# Altium project control_block_raspberry_pi_pico.PrjPcb
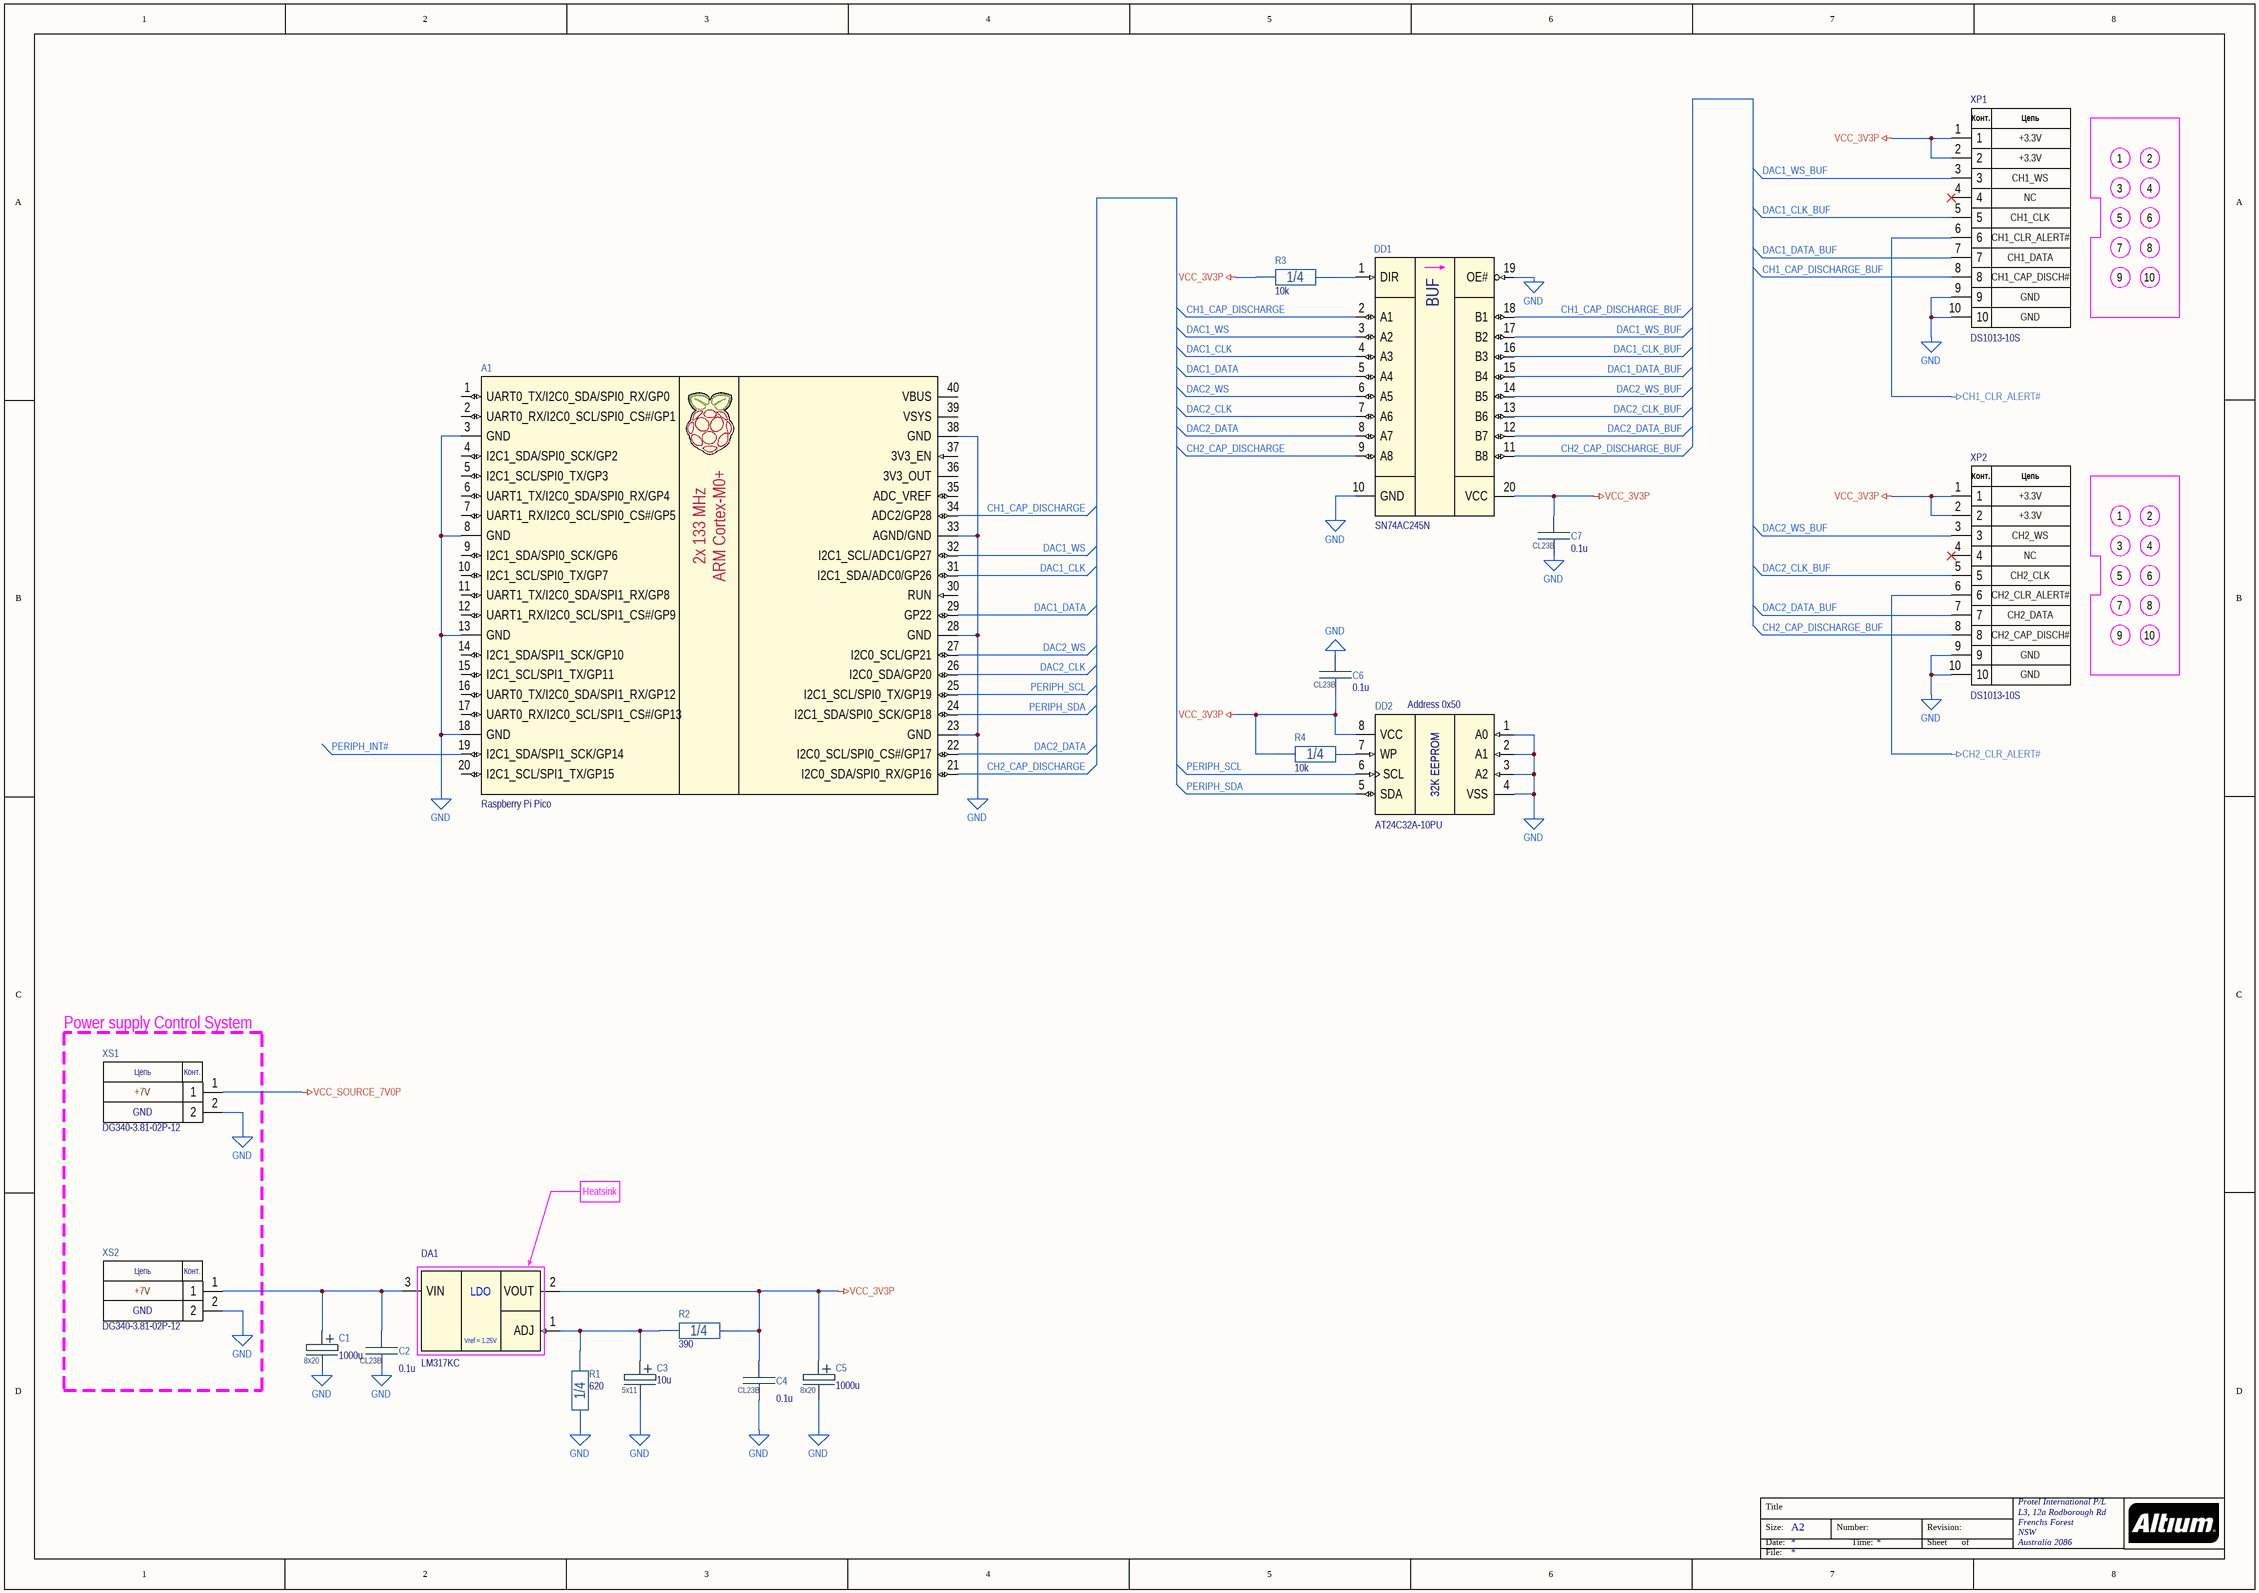
[diagram p0: p1_control_block.SchDoc]
4 sheets, 234 parts. Net scope: global (net labels, ports and power ports of the same name join across sheets).
Sheets:
  p1_control_block.SchDoc
  p2_eth_rs232.SchDoc
  p3_keypad_encoder_led.SchDoc
  p4_power_measure_ch1.SchDoc

## Sheet p1_control_block.SchDoc
size A2; Organization: Protel International P/L; Address1: L3, 12a Rodborough Rd; Address2: Frenchs Forest; Address3: NSW; Address4: Australia 2086

### Parts
A1  Raspberry Pi Pico  [Raspberry_Pi_Pico]
C1  1000u  Package: 8x20  [ECAP8X20X3.5_BRW]
C2  0.1u  [CL23B_7.2x2.5]
C3  10u  Package: 5x11  [ECAP5X11X2.0_BRW]
C4  0.1u  [CL23B_7.2x2.5]
C5  1000u  Package: 8x20  [ECAP8X20X3.5_BRW]
C6  0.1u  [CL23B_7.2x2.5]
C7  0.1u  [CL23B_7.2x2.5]
DA1  LM317KC  [TO-220A-3]
DD1  SN74AC245N  [DIP-20P-M01]
DD2  AT24C32A-10PU  [DIP-8P-M01_with_SO8]
R1  620  Package: 1/4  [CFR-25]
R2  390  Package: 1/4  [CFR-25]
R3  10k  Package: 1/4  [CFR-25]
R4  10k  Package: 1/4  [CFR-25]
XP1  DS1013-10S  [BH-10]
XP2  DS1013-10S  [BH-10]
XS1  DG340-3.81-02P-12  [DG340-3.81-02P]
XS2  DG340-3.81-02P-12  [DG340-3.81-02P]

### Blocks framed on the sheet
Power supply Control System: XS1 XS2

### Nets
CH1_CLR_ALERT#: XP1.6
CH2_CLR_ALERT#: XP2.6
GND: A1.3(GND) A1.8(GND) A1.13(GND) A1.18(GND) A1.23(GND) A1.28(GND) A1.33(AGND/GND) A1.38(GND) C1.2 C2.2 C3.2 C4.2 C5.2 C6.1 C7.2 DD1.10(GND) DD1.19(OE#) DD2.1(A0) DD2.2(A1) DD2.3(A2) DD2.4(VSS) R1.1 XP1.9 XP1.10 XP2.9 XP2.10 XS1.2 XS2.2
PERIPH_INT#: A1.19(I2C1_SDA/SPI1_SCK/GP14)
PERIPH_SCL: A1.25(I2C1_SCL/SPI0_TX/GP19) DD2.6(SCL)
PERIPH_SDA: A1.24(I2C1_SDA/SPI0_SCK/GP18) DD2.5(SDA)
VCC_3V3P: C4.1 C5.1 C6.2 C7.1 DA1.2(VOUT) DD1.20(VCC) DD2.8(VCC) R2.1 R3.1 R4.1 XP1.1 XP1.2 XP2.1 XP2.2
VCC_SOURCE_7V0P: XS1.1
CH1_CAP_DISCHARGE: A1.34(ADC2/GP28) DD1.2(A1)
CH1_CAP_DISCHARGE_BUF: DD1.18(B1) XP1.8
CH2_CAP_DISCHARGE: A1.21(I2C0_SDA/SPI0_RX/GP16) DD1.9(A8)
CH2_CAP_DISCHARGE_BUF: DD1.11(B8) XP2.8
DAC1_CLK: A1.31(I2C1_SDA/ADC0/GP26) DD1.4(A3)
DAC1_CLK_BUF: DD1.16(B3) XP1.5
DAC1_DATA: A1.29(GP22) DD1.5(A4)
DAC1_DATA_BUF: DD1.15(B4) XP1.7
DAC1_WS: A1.32(I2C1_SCL/ADC1/GP27) DD1.3(A2)
DAC1_WS_BUF: DD1.17(B2) XP1.3
DAC2_CLK: A1.26(I2C0_SDA/GP20) DD1.7(A6)
DAC2_CLK_BUF: DD1.13(B6) XP2.5
DAC2_DATA: A1.22(I2C0_SCL/SPI0_CS#/GP17) DD1.8(A7)
DAC2_DATA_BUF: DD1.12(B7) XP2.7
DAC2_WS: A1.27(I2C0_SCL/GP21) DD1.6(A5)
DAC2_WS_BUF: DD1.14(B5) XP2.3
NetC1_1: C1.1 C2.1 DA1.3(VIN) XS2.1
NetC3_1: C3.1 DA1.1(ADJ) R1.2 R2.2
NetDD1_1: DD1.1(DIR) R3.2
NetDD2_7: DD2.7(WP) R4.2

Not connected (* = marked no-connect by the designer): A1 1(UART0_TX/I2C0_SDA/SPI0_RX/GP0) 2(UART0_RX/I2C0_SCL/SPI0_CS#/GP1) 4(I2C1_SDA/SPI0_SCK/GP2) 5(I2C1_SCL/SPI0_TX/GP3) 6(UART1_TX/I2C0_SDA/SPI0_RX/GP4) 7(UART1_RX/I2C0_SCL/SPI0_CS#/GP5) 9(I2C1_SDA/SPI0_SCK/GP6) 10(I2C1_SCL/SPI0_TX/GP7) 11(UART1_TX/I2C0_SDA/SPI1_RX/GP8) 12(UART1_RX/I2C0_SCL/SPI1_CS#/GP9) 14(I2C1_SDA/SPI1_SCK/GP10) 15(I2C1_SCL/SPI1_TX/GP11) 16(UART0_TX/I2C0_SDA/SPI1_RX/GP12) 17(UART0_RX/I2C0_SCL/SPI1_CS#/GP13) 20(I2C1_SCL/SPI1_TX/GP15) 30(RUN) 35(ADC_VREF) 36(3V3_OUT) 37(3V3_EN) 39(VSYS) 40(VBUS); XP1 4*; XP2 4*

### Notes on the sheet
- +3.3V
- CH1_WS
- NC
- 1
- 3
- 2
- 4
- CH1_CLK
- (near XP1) CH1_CLR_ALERT#
- 5
- 7
- 6
- 8
- GND
- (near XP1) CH1_DATA
- (near XP1) CH1_CAP_DISCH#
- 9
- 10
- CH2_WS
- CH2_CLK
- (near XP2) CH2_CLR_ALERT#
- (near XP2) CH2_DATA
- (near XP2) CH2_CAP_DISCH#
- (near DD2) Address 0x50
- +7V
- Heatsink
- Title
- Size:
- Date:
- File:
- A2
- Number:
- Time:
- Revision:
- Sheet
- of
- (in symbol AT24C32A-10PU) 32K EEPROM
- (in symbol BH-10) Конт.; Цепь
- (in symbol DG340-3.81-02P-12) Цепь; Конт.
- (in symbol LM317KC) LDO; Vref = 1.25V
- (in symbol Raspberry Pi Pico) 2x 133 MHz; ARM Cortex-M0+
- (in symbol SN74AC245N) BUF

### Library data of the parts
A1 = Raspberry Pi Pico: Board Raspberry Pi Pico; Part Number: Raspberry Pi Pico; Manufacturer: Raspberry Pi
C1 C5 = C_ECAP: Aluminium capacitor; Part Number: UHV1C102MPD6; Manufacturer: Nichicon; Tolerance: ± 20 %; Voltage: 16V; Value: 1000u; Value on schem: 1000u
C2 C4 C6 C7 = CL23B: Box-type metallized polyester film capacitor; Tolerance: ± * %; Voltage: 63V; Value: 0.1u; Dielectric: Polyester; Value on schem: 0.1u; Part Number: *; Manufacturer: *; Package: CL23B
C3 = C_ECAP: Aluminium capacitor; Part Number: UVR1J100MDD1TA; Manufacturer: Nichicon; Tolerance: ± 20 %; Voltage: 63V; Value: 10u; Value on schem: 10u
DA1 = LM317KC: 1.5 A 3-Terminal Adjustable Regulator; Manufacturer: Texas Instruments; Package: TO-220; Part Number: LM317KC
DD1 = SN74AC245N: 8-bit Bus Transceiver with 3-state outputs; Manufacturer: Texas Instruments; Part Number: SN74AC245N; Package: DIP-20
DD2 = AT24C32A-10PU: 32K I2C Serial EEPROM; Manufacturer: Microchip Technology; Package: DIP-8; Part Number: AT24C32A-10PU
R1 = CF25: Resistor 1/4W; Part Number: MFR-25FTF52-620R; Manufacturer: Yageo; Tolerance: ± 1 %; Voltage: 250V; Temperature Coefficient: ±100 ppm/°C; Value: 620; Value on schem: 620
R2 = CF25: Resistor 1/4W; Part Number: MFR-25FTF52-390R; Manufacturer: Yageo; Tolerance: ± 1 %; Voltage: 250V; Temperature Coefficient: ±100 ppm/°C; Value: 390; Value on schem: 390
R3 R4 = CF25: Resistor 1/4W; Part Number: MFR-25FTF52-10K; Manufacturer: Yageo; Tolerance: ± 1 %; Voltage: 250V; Temperature Coefficient: ±100 ppm/°C; Value: 10k; Value on schem: 10k
XP1 XP2 = BH-10: 10-pin 2.54 mm Box header elevator type; Manufacturer: Connfly; Part Number: DS1013-10S
XS1 XS2 = DG340-3.81-02P-12: 2-way screw terminal, pitch 150mils (3.81mm); Manufacturer: DEGSON; Part Number: DG340-3.81-02P-12

## Sheet p2_eth_rs232.SchDoc
size A1; Organization: Protel International P/L; Address1: L3, 12a Rodborough Rd; Address2: Frenchs Forest; Address3: NSW; Address4: Australia 2086
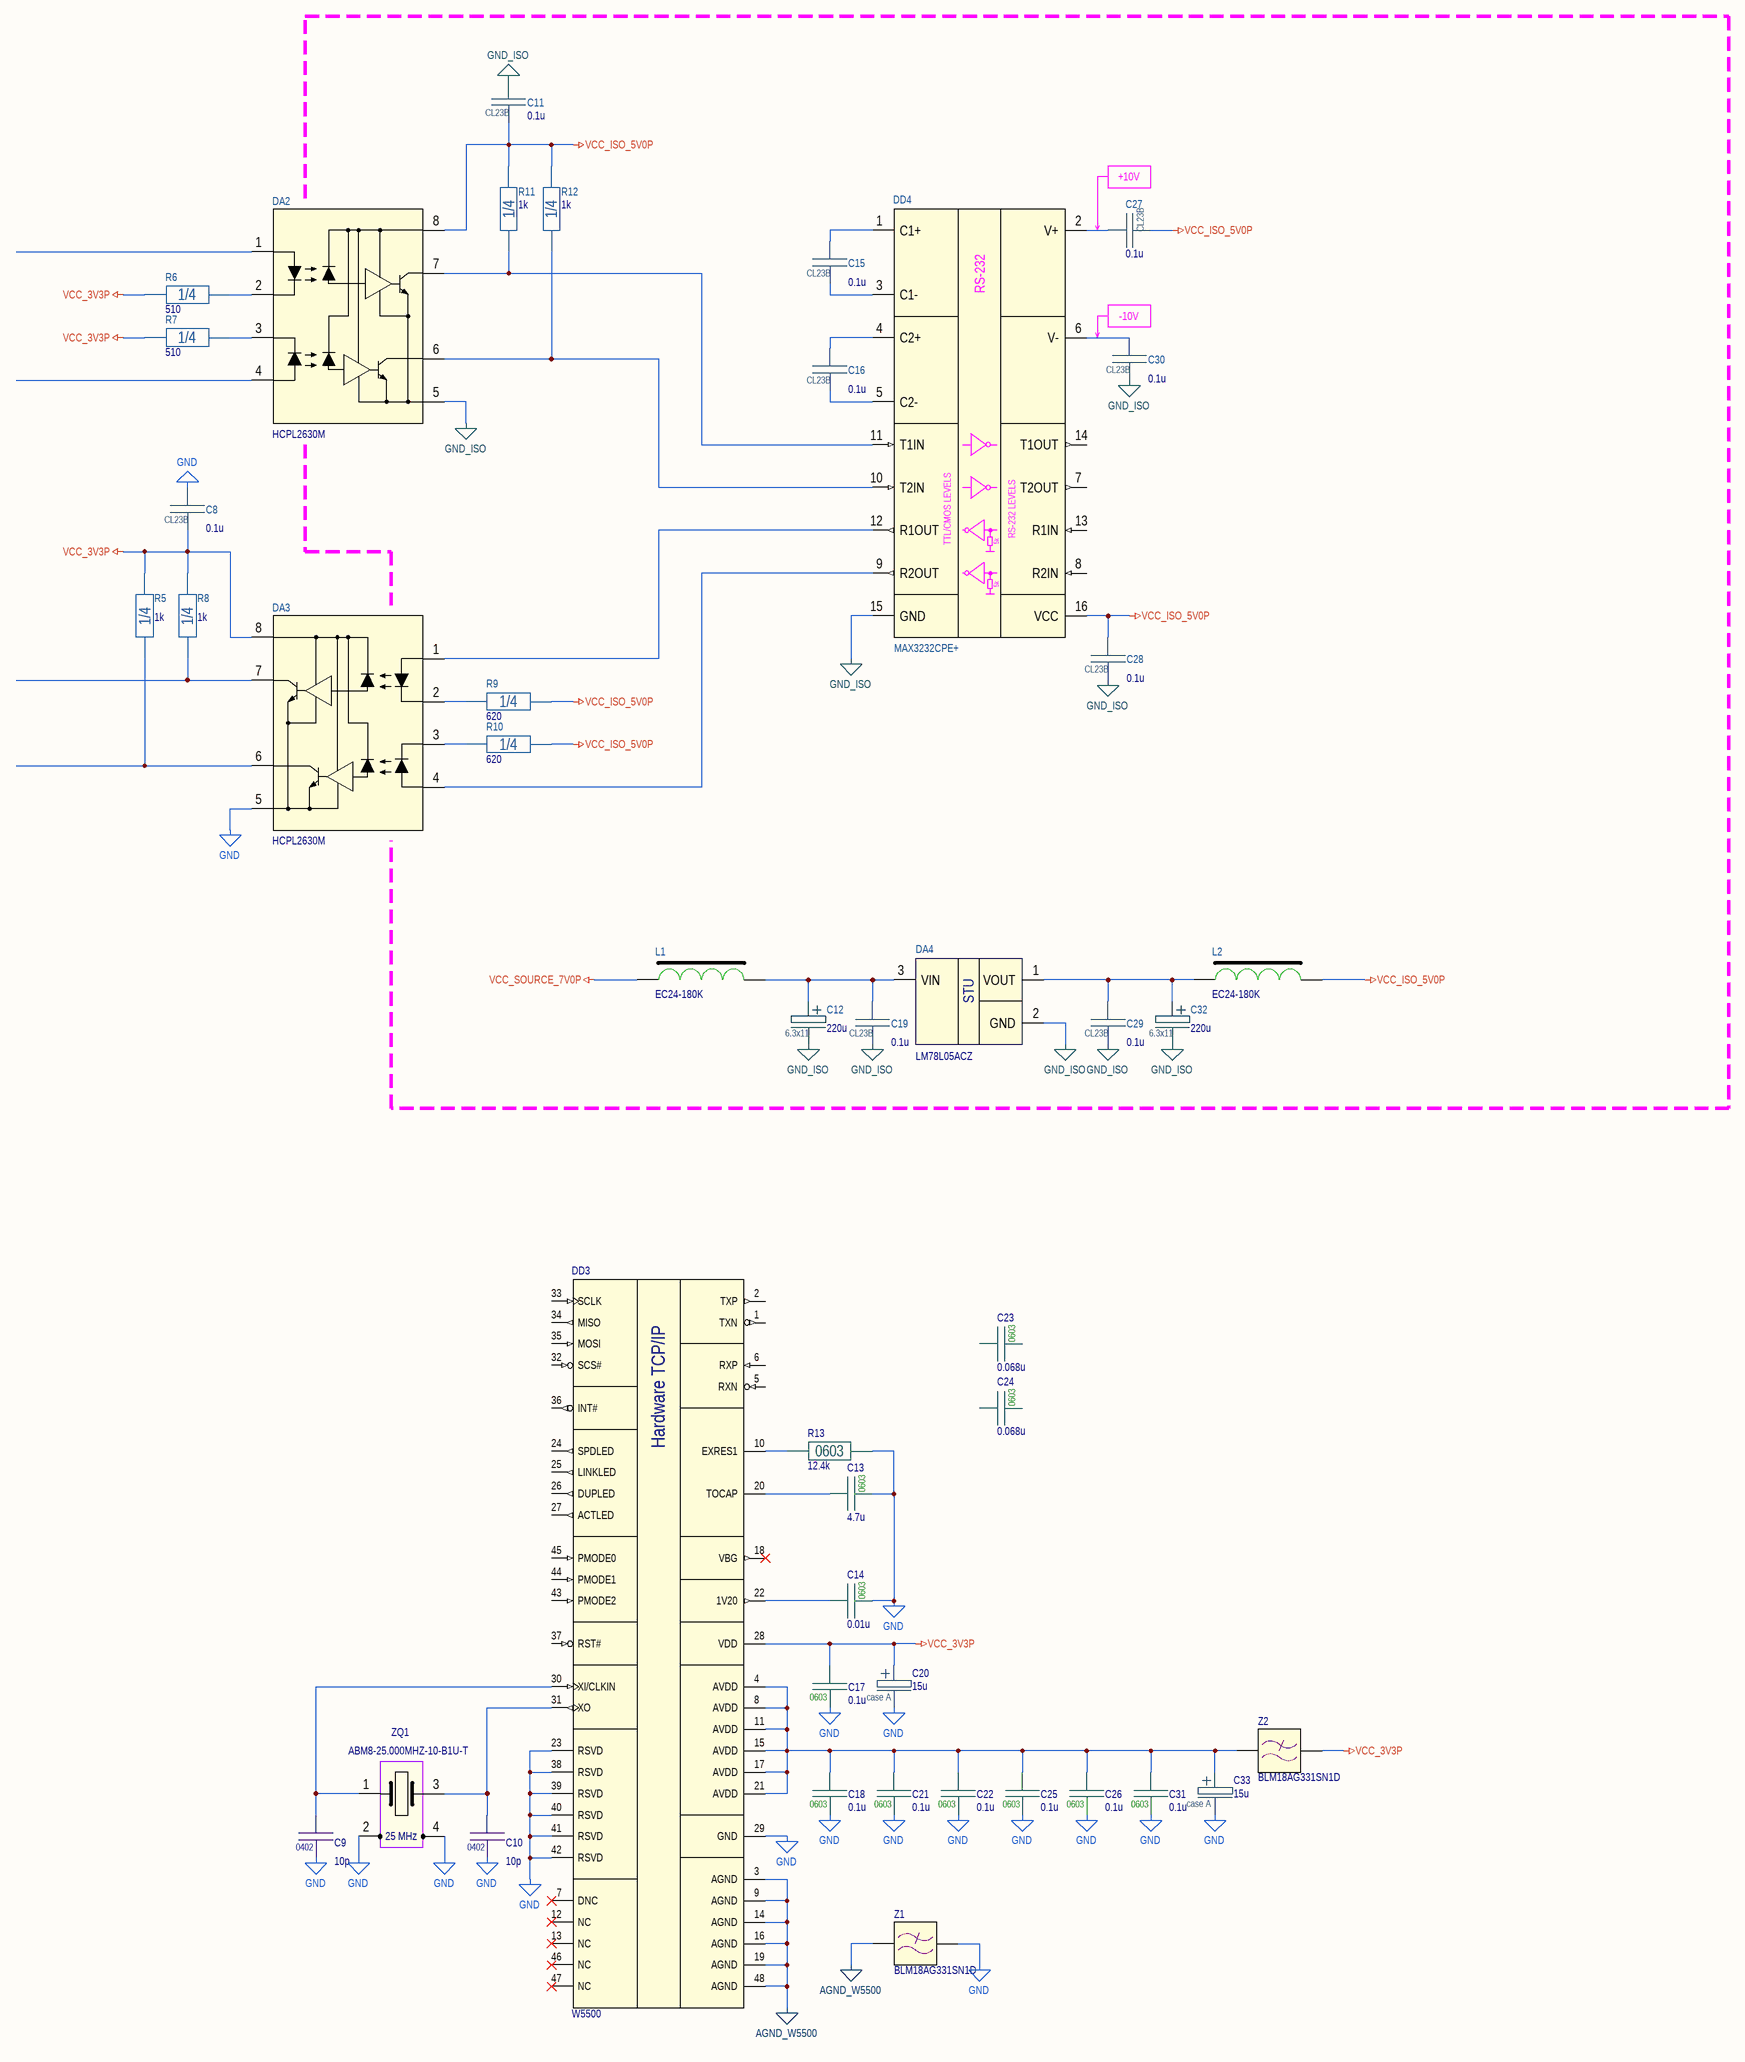
[diagram p1: p2_eth_rs232.SchDoc]

### Parts
C8  0.1u  [CL23B_7.2x2.5]
C9  10p  Package: 0402  [CAP0402]
C10  10p  Package: 0402  [CAP0402]
C11  0.1u  [CL23B_7.2x2.5]
C12  220u  Package: 6.3x11  [ECAP6.3X11X2.5_BRW]
C13  4.7u  Package: 0603  [CAP0603]
C14  0.01u  Package: 0603  [CAP0603]
C15  0.1u  [CL23B_7.2x2.5]
C16  0.1u  [CL23B_7.2x2.5]
C17  0.1u  Package: 0603  [CAP0603]
C18  0.1u  Package: 0603  [CAP0603]
C19  0.1u  [CL23B_7.2x2.5]
C20  15u  Package: case A  [CAP_CASE_A]
C21  0.1u  Package: 0603  [CAP0603]
C22  0.1u  Package: 0603  [CAP0603]
C23  0.068u  Package: 0603  [CAP0603]
C24  0.068u  Package: 0603  [CAP0603]
C25  0.1u  Package: 0603  [CAP0603]
C26  0.1u  Package: 0603  [CAP0603]
C27  0.1u  [CL23B_7.2x2.5]
C28  0.1u  [CL23B_7.2x2.5]
C29  0.1u  [CL23B_7.2x2.5]
C30  0.1u  [CL23B_7.2x2.5]
C31  0.1u  Package: 0603  [CAP0603]
C32  220u  Package: 6.3x11  [ECAP6.3X11X2.5_BRW]
C33  15u  Package: case A  [CAP_CASE_A]
DA2  HCPL2630M  [DIP-8P-M01]
DA3  HCPL2630M  [DIP-8P-M01]
DA4  LM78L05ACZ  [TO-92 (VERTICAL,LINE)]
DD3  W5500  [LQFP-48]
DD4  MAX3232CPE+  [DIP-16P-M03]
L1  EC24-180K  [EC24_GREEN]
L2  EC24-180K  [EC24_GREEN]
R5  1k  Package: 1/4  [CFR-25]
R6  510  Package: 1/4  [CFR-25]
R7  510  Package: 1/4  [CFR-25]
R8  1k  Package: 1/4  [CFR-25]
R9  620  Package: 1/4  [CFR-25]
R10  620  Package: 1/4  [CFR-25]
R11  1k  Package: 1/4  [CFR-25]
R12  1k  Package: 1/4  [CFR-25]
R13  12.4k  Package: 0603  [RES0603B]
Z1  BLM18AG331SN1D  [BLM0603P]
Z2  BLM18AG331SN1D  [BLM0603P]
ZQ1  ABM8-25.000MHZ-10-B1U-T  [SMD3225]

### Nets
AGND_W5500: DD3.3(AGND) DD3.9(AGND) DD3.14(AGND) DD3.16(AGND) DD3.19(AGND) DD3.48(AGND) Z1.2
GND: C8.1 C9.1 C10.1 C13.2 C14.2 C17.1 C18.1 C20.2 C21.1 C22.1 C25.1 C26.1 C31.1 C33.2 DA3.5(GND) DD3.23(RSVD) DD3.29(GND) DD3.38(RSVD) DD3.39(RSVD) DD3.40(RSVD) DD3.41(RSVD) DD3.42(RSVD) R13.2 Z1.1 ZQ1.2(GND) ZQ1.4(GND)
GND_ISO: C11.1 C12.2 C19.2 C28.2 C29.2 C30.2 C32.2 DA2.5(GND) DA4.2(GND) DD4.15(GND)
VCC_3V3P: C8.2 C17.2 C20.1 DA3.8(VCC) DD3.28(VDD) R5.1 R6.1 R7.1 R8.1 Z2.1
VCC_ISO_5V0P: C11.2 C27.2 C28.1 DA2.8(VCC) DD4.16(VCC) L2.2 R9.1 R10.1 R11.1 R12.1
VCC_SOURCE_7V0P: L1.1
NetC9_2: C9.2 DD3.30(XI/CLKIN) ZQ1.1(XTAL0)
NetC10_2: C10.2 DD3.31(XO) ZQ1.3(XTAL1)
NetC12_1: C12.1 C19.1 DA4.3(VIN) L1.2
NetC13_1: C13.1 DD3.20(TOCAP)
NetC14_1: C14.1 DD3.22(1V20)
NetC15_1: C15.1 DD4.1(C1+)
NetC15_2: C15.2 DD4.3(C1-)
NetC16_1: C16.1 DD4.4(C2+)
NetC16_2: C16.2 DD4.5(C2-)
NetC18_2: C18.2 C21.2 C22.2 C25.2 C26.2 C31.2 C33.1 DD3.4(AVDD) DD3.8(AVDD) DD3.11(AVDD) DD3.15(AVDD) DD3.17(AVDD) DD3.21(AVDD) Z2.2
NetC27_1: C27.1 DD4.2(V+)
NetC29_1: C29.1 C32.1 DA4.1(VOUT) L2.1
NetC30_1: C30.1 DD4.6(V-)
NetDA2_2: DA2.2(CATHODE1) R6.2
NetDA2_3: DA2.3(CATHODE2) R7.2
NetDA2_6: DA2.6(V02) DD4.10(T2IN) R12.2
NetDA2_7: DA2.7(V01) DD4.11(T1IN) R11.2
NetDA3_1: DA3.1(ANODE1) DD4.12(R1OUT)
NetDA3_2: DA3.2(CATHODE1) R9.2
NetDA3_3: DA3.3(CATHODE2) R10.2
NetDA3_4: DA3.4(ANODE2) DD4.9(R2OUT)
NetDA3_6: DA3.6(V02) R5.2
NetDA3_7: DA3.7(V01) R8.2
NetDD3_10: DD3.10(EXRES1) R13.1

Not connected (* = marked no-connect by the designer): C23 1 2; C24 1 2; DA2 1(ANODE1) 4(ANODE2); DD3 1(TXN) 2(TXP) 5(RXN) 6(RXP) 7(DNC)* 12(NC)* 13(NC)* 18(VBG)* 24(SPDLED) 25(LINKLED) 26(DUPLED) 27(ACTLED) 32(SCS#) 33(SCLK) 34(MISO) 35(MOSI) 36(INT#) 37(RST#) 43(PMODE2) 44(PMODE1) 45(PMODE0) 46(NC)* 47(NC)*; DD4 7(T2OUT) 8(R2IN) 13(R1IN) 14(T1OUT)

### Notes on the sheet
- +10V
- -10V
- Title
- Size:
- Date:
- File:
- A1
- Number:
- Time:
- Revision:
- Sheet
- of
- (in symbol ABM8-25.000MHZ-10-B1U-T) 25 MHz
- (in symbol LM78L05ACZ) STU
- (in symbol MAX3232CPE+) RS-232; TTL/CMOS LEVELS; RS-232 LEVELS; 5k
- (in symbol W5500) Hardware TCP/IP

### Library data of the parts
C8 C11 C15 C16 C19 C27-C30 = CL23B: as C2 on sheet p1_control_block; Value: 0.1u; Dielectric: Polyester; Value on schem: 0.1u; Part Number: *; Manufacturer: *; Package: CL23B
C9 C10 = C0402: Capacitors 0402 package case; Part Number: CL05C100JB5NNNC; Manufacturer: Samsung Sdi Co.ltd(SAMSUNG); Tolerance: ± 10 %; Dielectric: NP0; Voltage: 50 V; Value: 10p; Value on schem: 10p
C12 C32 = C_ECAP: Aluminium capacitor; Part Number: EKZH160ELL221MF11D; Manufacturer: Nichicon; Tolerance: ± 20 %; Voltage: 16V; Value: 220u; Value on schem: 220u
C13 = C0603: Capacitors 0603 package case; Part Number: CL10A475MO8NNNC; Manufacturer: Samsung Sdi Co. Ltd; Tolerance: ± 10 %; Dielectric: X5R; Voltage: 16 V; Value: 4.7u; Value on schem: 4.7u
C14 = C0603: Capacitors 0603 package case; Part Number: CL10B103KB8NNNL; Manufacturer: Samsung Sdi Co. Ltd; Tolerance: ± 10 %; Dielectric: X7R; Voltage: 50 V; Value: 0.01u; Value on schem: 0.01u
C17 C18 C21 C22 C25 C26 C31 = C0603: Capacitors 0603 package case; Part Number: CL10B104KB8NNNC; Manufacturer: Samsung Sdi Co. Ltd; Tolerance: ± 10 %; Dielectric: X7R; Voltage: 50V; Value: 0.1u; Value on schem: 0.1u
C20 C33 = C_CASEA: Tantalum capacitors case A; Part Number: 293D156X96R3A2TE3; Manufacturer: Vishay Intertechnology Inc.; Tolerance: ± 10 %; Voltage: 6.3V; ESR: 2.9Ohm @ 100 kHz; Value: 15u; Value on schem: 15u; Series: 293D
C23 C24 = C0603: Capacitors 0603 package case; Part Number: CL10B683KB8NNNC; Manufacturer: Samsung Sdi Co. Ltd; Tolerance: ± 10 %; Dielectric: X7R; Voltage: 50 V; Value: 0.068u; Value on schem: 0.068u
DA2 DA3 = HCPL2630M: Dual-Channel High-Speed 10 MBit/s Logic Gate Optocouplers; Manufacturer: ON Semiconductor; Package: DIP-8; Part Number: HCPL2630M
DA4 = LM78L05ACZ: 100-mA Fixed Output Linear Regulator; Manufacturer: Texas Instruments; Part Number: LM78L05ACZ; Package: TO-92
DD3 = W5500: Hardwired TCP/IP embedded Ethernet controller; Manufacturer: WIZnet; Part Number: W5500; Package: LQFP-64
DD4 = MAX3232CPE+: 3.0V to 5.5V, Low-Power, Up to 1Mbps, True RS-232 Transceivers; Manufacturer: Maxim Integrated; Part Number: MAX3232CPE+; Package: DIP-16
L1 L2 = EC24: Axial leaded coated inductors; Manufacturer: 3L Electronic; RDC: 1 Ohm; SRF Min: 15 MHz; Q: 40; Irms  Max: 315 mA; Inductance @ 100 kHz: 18 µH; Part Number: EC24-180K; Package: EC24
R5 R8 R11 R12 = CF25: Resistor 1/4W; Part Number: MFR-25FTF52-1K; Manufacturer: Yageo; Tolerance: ± 1 %; Voltage: 250V; Temperature Coefficient: ±100 ppm/°C; Value: 1k; Value on schem: 1k
R6 R7 = CF25: Resistor 1/4W; Part Number: MFR-25FTF52-510R; Manufacturer: Yageo; Tolerance: ± 1 %; Voltage: 250V; Temperature Coefficient: ±100 ppm/°C; Value: 510; Value on schem: 510
R9 R10 = CF25: as R1 on sheet p1_control_block; Value: 620; Value on schem: 620
R13 = R0603: Resistor 0603 package case; Part Number: RC0603FR-0712K4L; Manufacturer: Yageo; Tolerance: ± 1 %; Value: 12.4k; Value on schem: 12.4k
Z1 Z2 = BLM18AG331SN1D: Power line filter, imperdance 330 Ohm (current 05A); Part Number: BLM18AG331SN1D; Package: 0603
ZQ1 = ABM8-25.000MHZ-10-B1U-T: Quartz Crystal (Frequency Stability ±10ppm); Manufacturer: Abracon LLC; Load Capacitance: 10pF; PartNumber: ABM8-25.000MHZ-10-B1U-T; Package: SMD3225; Frequency Tolerance: ±10ppm; Frequency Stability: ±10ppm

## Sheet p3_keypad_encoder_led.SchDoc
size A2; Organization: Protel International P/L; Address1: L3, 12a Rodborough Rd; Address2: Frenchs Forest; Address3: NSW; Address4: Australia 2086
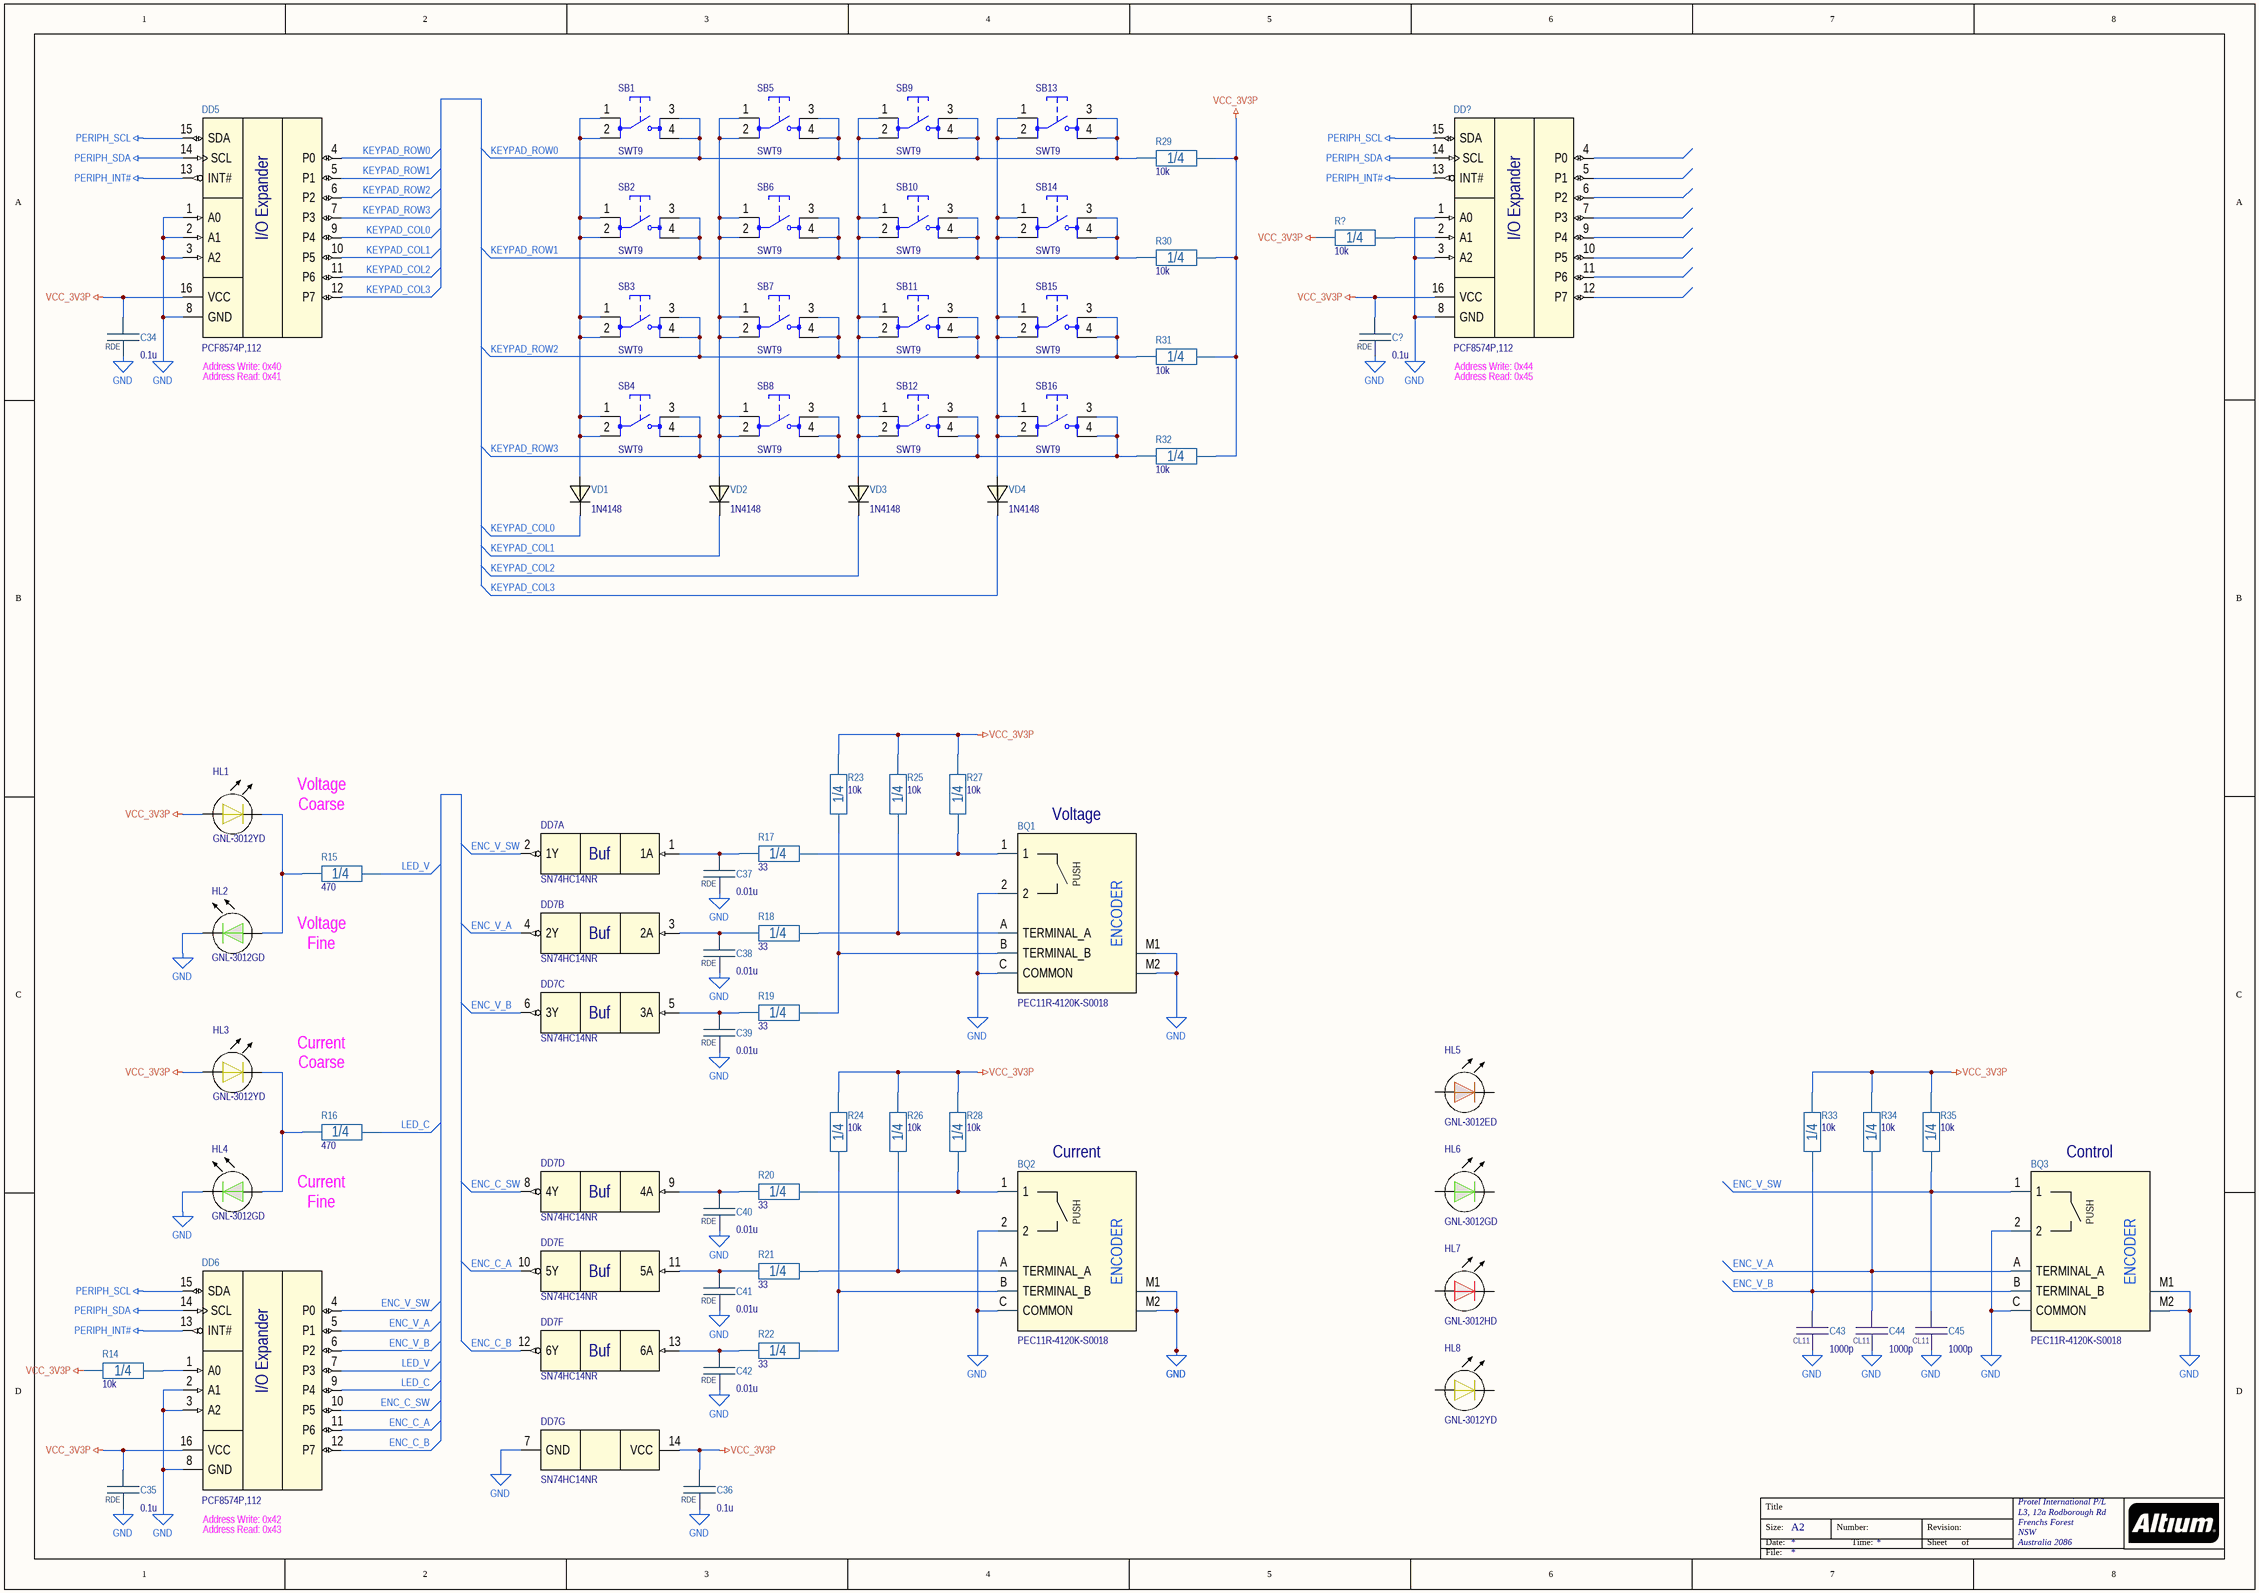
[diagram p2: p3_keypad_encoder_led.SchDoc]

### Parts
BQ1  PEC11R-4120K-S0018  [PEC11R-4120K-S0018]
BQ2  PEC11R-4120K-S0018  [PEC11R-4120K-S0018]
BQ3  PEC11R-4120K-S0018  [PEC11R-4120K-S0018]
C34  0.1u  Package: RDE  [RDE_1P1]
C35  0.1u  Package: RDE  [RDE_1P1]
C36  0.1u  Package: RDE  [RDE_1P1]
C37  0.01u  Package: RDE  [RDE_1P1]
C38  0.01u  Package: RDE  [RDE_1P1]
C39  0.01u  Package: RDE  [RDE_1P1]
C40  0.01u  Package: RDE  [RDE_1P1]
C41  0.01u  Package: RDE  [RDE_1P1]
C42  0.01u  Package: RDE  [RDE_1P1]
C43  1000p  [CL11_6x3.5_P3.5]
C44  1000p  [CL11_6x3.5_P3.5]
C45  1000p  [CL11_6x3.5_P3.5]
C?  0.1u  Package: RDE  [RDE_1P1]
DD5  PCF8574P,112  [DIP-16P-M03]
DD6  PCF8574P,112  [DIP-16P-M03]
DD7  SN74HC14NR  [DIP-14P-M02]  (parts A,B,C,D,E,F,G of 7)
DD?  PCF8574P,112  [DIP-16P-M03]
HL1  GNL-3012YD  [GNL-3012YD]
HL2  GNL-3012GD  [GNL-3012GD]
HL3  GNL-3012YD  [GNL-3012YD]
HL4  GNL-3012GD  [GNL-3012GD]
HL5  GNL-3012ED  [GNL-3012ED]
HL6  GNL-3012GD  [GNL-3012GD]
HL7  GNL-3012HD  [GNL-3012HD]
HL8  GNL-3012YD  [GNL-3012YD]
R14  10k  Package: 1/4  [CFR-25]
R15  470  Package: 1/4  [CFR-25]
R16  470  Package: 1/4  [CFR-25]
R17  33  Package: 1/4  [CFR-25]
R18  33  Package: 1/4  [CFR-25]
R19  33  Package: 1/4  [CFR-25]
R20  33  Package: 1/4  [CFR-25]
R21  33  Package: 1/4  [CFR-25]
R22  33  Package: 1/4  [CFR-25]
R23  10k  Package: 1/4  [CFR-25]
R24  10k  Package: 1/4  [CFR-25]
R25  10k  Package: 1/4  [CFR-25]
R26  10k  Package: 1/4  [CFR-25]
R27  10k  Package: 1/4  [CFR-25]
R28  10k  Package: 1/4  [CFR-25]
R29  10k  Package: 1/4  [CFR-25]
R30  10k  Package: 1/4  [CFR-25]
R31  10k  Package: 1/4  [CFR-25]
R32  10k  Package: 1/4  [CFR-25]
R33  10k  Package: 1/4  [CFR-25]
R34  10k  Package: 1/4  [CFR-25]
R35  10k  Package: 1/4  [CFR-25]
R?  10k  Package: 1/4  [CFR-25]
SB1  SWT9  [SWT9]
SB2  SWT9  [SWT9]
SB3  SWT9  [SWT9]
SB4  SWT9  [SWT9]
SB5  SWT9  [SWT9]
SB6  SWT9  [SWT9]
SB7  SWT9  [SWT9]
SB8  SWT9  [SWT9]
SB9  SWT9  [SWT9]
SB10  SWT9  [SWT9]
SB11  SWT9  [SWT9]
SB12  SWT9  [SWT9]
SB13  SWT9  [SWT9]
SB14  SWT9  [SWT9]
SB15  SWT9  [SWT9]
SB16  SWT9  [SWT9]
VD1  1N4148  [DO-35 GLASS LIGHT RED]
VD2  1N4148  [DO-35 GLASS LIGHT RED]
VD3  1N4148  [DO-35 GLASS LIGHT RED]
VD4  1N4148  [DO-35 GLASS LIGHT RED]

### Nets
GND: BQ1.2 BQ1.C(COMMON) BQ1.M1(MECHANICAL1) BQ1.M2(MECHANICAL2) BQ2.2 BQ2.C(COMMON) BQ2.M1(MECHANICAL1) BQ2.M2(MECHANICAL2) BQ3.2 BQ3.C(COMMON) BQ3.M1(MECHANICAL1) BQ3.M2(MECHANICAL2) C34.2 C35.2 C36.2 C37.2 C38.2 C39.2 C40.2 C41.2 C42.2 C43.1 C44.1 C45.1 C?.2 DD5.1(A0) DD5.2(A1) DD5.3(A2) DD5.8(GND) DD6.2(A1) DD6.3(A2) DD6.8(GND) DD7.7(GND) DD?.1(A0) DD?.3(A2) DD?.8(GND) HL2.1 HL4.1
PERIPH_INT#: DD5.13(INT#) DD6.13(INT#) DD?.13(INT#)
PERIPH_SCL: DD5.15(SDA) DD6.15(SDA) DD?.15(SDA)
PERIPH_SDA: DD5.14(SCL) DD6.14(SCL) DD?.14(SCL)
VCC_3V3P: C34.1 C35.1 C36.1 C?.1 DD5.16(VCC) DD6.16(VCC) DD7.14(VCC) DD?.16(VCC) HL1.2 HL3.2 R14.2 R23.2 R24.2 R25.2 R26.2 R27.2 R28.2 R29.1 R30.1 R31.1 R32.1 R33.2 R34.2 R35.2 R?.2
ENC_C_A: DD6.11(P6) DD7.10(5Y)
ENC_C_B: DD6.12(P7) DD7.12(6Y)
ENC_C_SW: DD6.10(P5) DD7.8(4Y)
ENC_V_A: BQ3.A(TERMINAL_A) C44.2 DD6.5(P1) DD7.4(2Y) R34.1
ENC_V_B: BQ3.B(TERMINAL_B) C43.2 DD6.6(P2) DD7.6(3Y) R33.1
ENC_V_SW: BQ3.1 C45.2 DD6.4(P0) DD7.2(1Y) R35.1
KEYPAD_COL0: DD5.9(P4) VD1.1
KEYPAD_COL1: DD5.10(P5) VD2.1
KEYPAD_COL2: DD5.11(P6) VD3.1
KEYPAD_COL3: DD5.12(P7) VD4.1
KEYPAD_ROW0: DD5.4(P0) R29.2 SB1.3 SB1.4 SB5.3 SB5.4 SB9.3 SB9.4 SB13.3 SB13.4
KEYPAD_ROW1: DD5.5(P1) R30.2 SB2.3 SB2.4 SB6.3 SB6.4 SB10.3 SB10.4 SB14.3 SB14.4
KEYPAD_ROW2: DD5.6(P2) R31.2 SB3.3 SB3.4 SB7.3 SB7.4 SB11.3 SB11.4 SB15.3 SB15.4
KEYPAD_ROW3: DD5.7(P3) R32.2 SB4.3 SB4.4 SB8.3 SB8.4 SB12.3 SB12.4 SB16.3 SB16.4
LED_C: DD6.9(P4) R16.1
LED_V: DD6.7(P3) R15.1
NetBQ1_1: BQ1.1 R17.1 R27.1
NetBQ1_A: BQ1.A(TERMINAL_A) R18.1 R25.1
NetBQ1_B: BQ1.B(TERMINAL_B) R19.1 R23.1
NetBQ2_1: BQ2.1 R20.1 R28.1
NetBQ2_A: BQ2.A(TERMINAL_A) R21.1 R26.1
NetBQ2_B: BQ2.B(TERMINAL_B) R22.1 R24.1
NetC37_1: C37.1 DD7.1(1A) R17.2
NetC38_1: C38.1 DD7.3(2A) R18.2
NetC39_1: C39.1 DD7.5(3A) R19.2
NetC40_1: C40.1 DD7.9(4A) R20.2
NetC41_1: C41.1 DD7.11(5A) R21.2
NetC42_1: C42.1 DD7.13(6A) R22.2
NetDD6_1: DD6.1(A0) R14.1
NetDD?_2: DD?.2(A1) R?.1
NetHL1_1: HL1.1 HL2.2 R15.2
NetHL3_1: HL3.1 HL4.2 R16.2
NetSB1_1: SB1.1 SB1.2 SB2.1 SB2.2 SB3.1 SB3.2 SB4.1 SB4.2 VD1.2
NetSB5_1: SB5.1 SB5.2 SB6.1 SB6.2 SB7.1 SB7.2 SB8.1 SB8.2 VD2.2
NetSB9_1: SB9.1 SB9.2 SB10.1 SB10.2 SB11.1 SB11.2 SB12.1 SB12.2 VD3.2
NetSB13_1: SB13.1 SB13.2 SB14.1 SB14.2 SB15.1 SB15.2 SB16.1 SB16.2 VD4.2

Not connected (* = marked no-connect by the designer): DD? 4(P0) 5(P1) 6(P2) 7(P3) 9(P4) 10(P5) 11(P6) 12(P7); HL5 1 2; HL6 1 2; HL7 1 2; HL8 1 2

### Notes on the sheet
- Address Write: 0x40
- Address Read: 0x41
- Address Write: 0x44
- Address Read: 0x45
- Voltage
- Coarse
- (near BQ1) Voltage
- Fine
- Current
- (near BQ2) Current
- (near BQ3) Control
- Address Write: 0x42
- Address Read: 0x43
- Title
- Size:
- Date:
- File:
- A2
- Number:
- Time:
- Revision:
- Sheet
- of
- (in symbol PCF8574P,112) I/O Expander
- (in symbol PEC11R-4120K-S0018) PUSH; ENCODER
- (in symbol SN74HC14NR, part A) Buf
- (in symbol SN74HC14NR, part B) Buf
- (in symbol SN74HC14NR, part C) Buf
- (in symbol SN74HC14NR, part D) Buf
- (in symbol SN74HC14NR, part E) Buf
- (in symbol SN74HC14NR, part F) Buf

### Library data of the parts
BQ1-BQ3 = PEC11R-4120K-S0018: 12 mm Incremental Encoder; Manufacturer: Bourns Inc.; Part Number: PEC11R-4120K-S0018
C34-C36 C? = RDE_CAP: MLCC radial lead type with epoxy coat (RDE Series); Part Number: RDER72A104K1P1H03B; Manufacturer: Murata; Tolerance: ± 10 %; Dielectric: X7R; Voltage: 100V; Value: 0.1u; Value on schem: 0.1u
C37-C42 = RDE_CAP: MLCC radial lead type with epoxy coat (RDE Series); Part Number: RDER71H103K; Manufacturer: Murata; Tolerance: ± 10 %; Dielectric: X7R; Voltage: 50V; Value: 0.01u; Value on schem: 0.01u
C43-C45 = CL11: CL11 Type Polyester Film Metal Foil Capacitor-inductive; Tolerance: ± 5 %; Voltage: 100V; Value: 1000p; Dielectric: Polyester; Value on schem: 1000p; Part Number: *; Manufacturer: *; Package: CL11
DD5 DD6 DD? = PCF8574P,112: Remote 8-bit I/O expander for I2C-bus; Manufacturer: NXP USA Inc.; Package: DIP-16; Part Number: PCF8574P,112
DD7 = SN74HC14NR: Hex Inverters with Schmitt-Trigger Inputs; Manufacturer: Texas Instruments; Part Number: SN74HC14NR; Package: DIP-14
HL1 HL3 HL8 = GNL-3012YD: Standard Brightness 3mm LED; Manufacturer: G-Nor Optoelectronics; Color: Yellow, 585 nm; Package: 3mm; Part Number: GNL-3012YD
HL2 HL4 HL6 = GNL-3012GD: Standard Brightness 3mm LED; Manufacturer: G-Nor Optoelectronics; Color: Green, 565 nm; Package: 3mm; Part Number: GNL-3012GD
HL5 = GNL-3012ED: Standard Brightness 3mm LED; Manufacturer: G-Nor Optoelectronics; Color: Orange, 635 nm; Package: 3mm; Part Number: GNL-3012ED
HL7 = GNL-3012HD: Standard Brightness 3mm LED; Manufacturer: G-Nor Optoelectronics; Color: Red, 700 nm; Package: 3mm; Part Number: GNL-3012HD
R14 R23-R35 R? = CF25: as R3 on sheet p1_control_block; Value: 10k; Value on schem: 10k
R15 R16 = CF25: Resistor 1/4W; Part Number: MFR-25FTF52-470R; Manufacturer: Yageo; Tolerance: ± 1 %; Voltage: 250V; Temperature Coefficient: ±100 ppm/°C; Value: 470; Value on schem: 470
R17-R22 = CF25: Resistor 1/4W; Part Number: MFR-25FTF52-33R; Manufacturer: Yageo; Tolerance: ± 1 %; Voltage: 250V; Temperature Coefficient: ±100 ppm/°C; Value: 33; Value on schem: 33
SB1-SB16 = SWT9: Tact Button (with tact cap SWT9S); Part Number: SWT9
VD1-VD4 = 1N4148: High-speed diode; Package: DO-35; Part Number: 1N4148

## Sheet p4_power_measure_ch1.SchDoc
size A1; Organization: Protel International P/L; Address1: L3, 12a Rodborough Rd; Address2: Frenchs Forest; Address3: NSW; Address4: Australia 2086
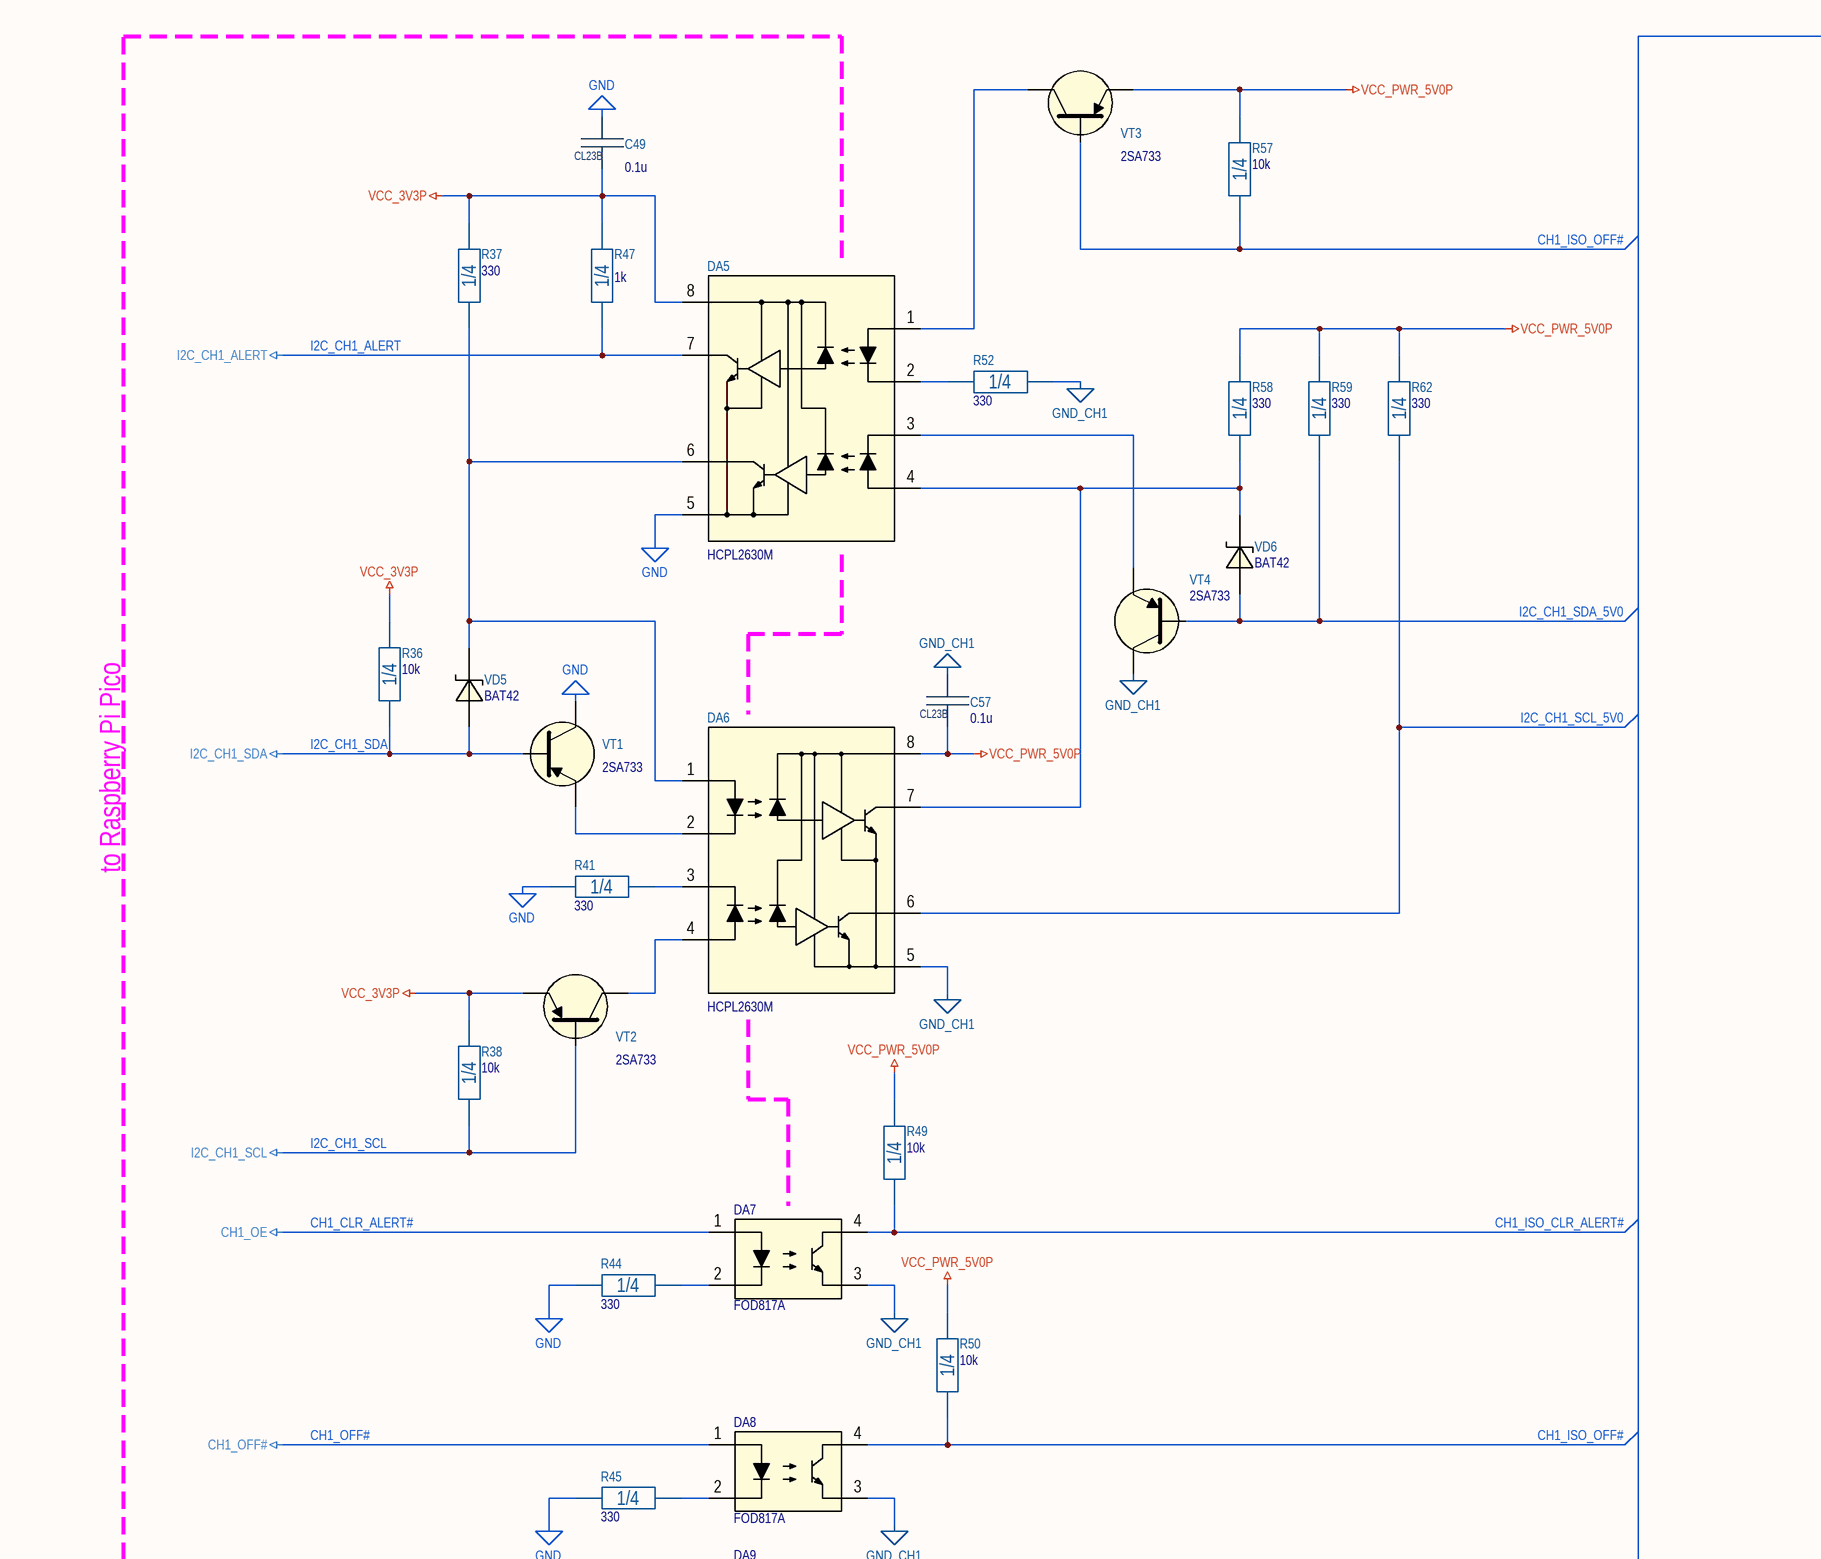
[diagram p3: p4_power_measure_ch1.SchDoc, top left]
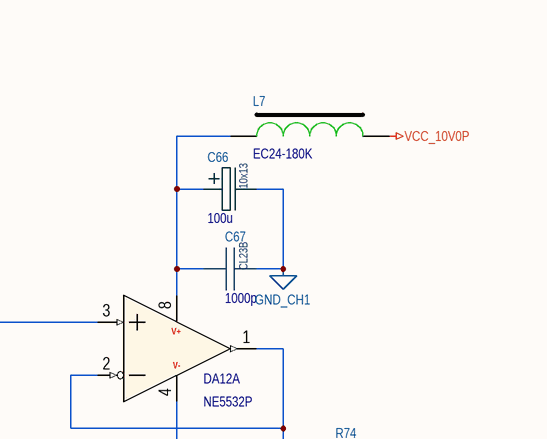
[diagram p4: p4_power_measure_ch1.SchDoc, top right]
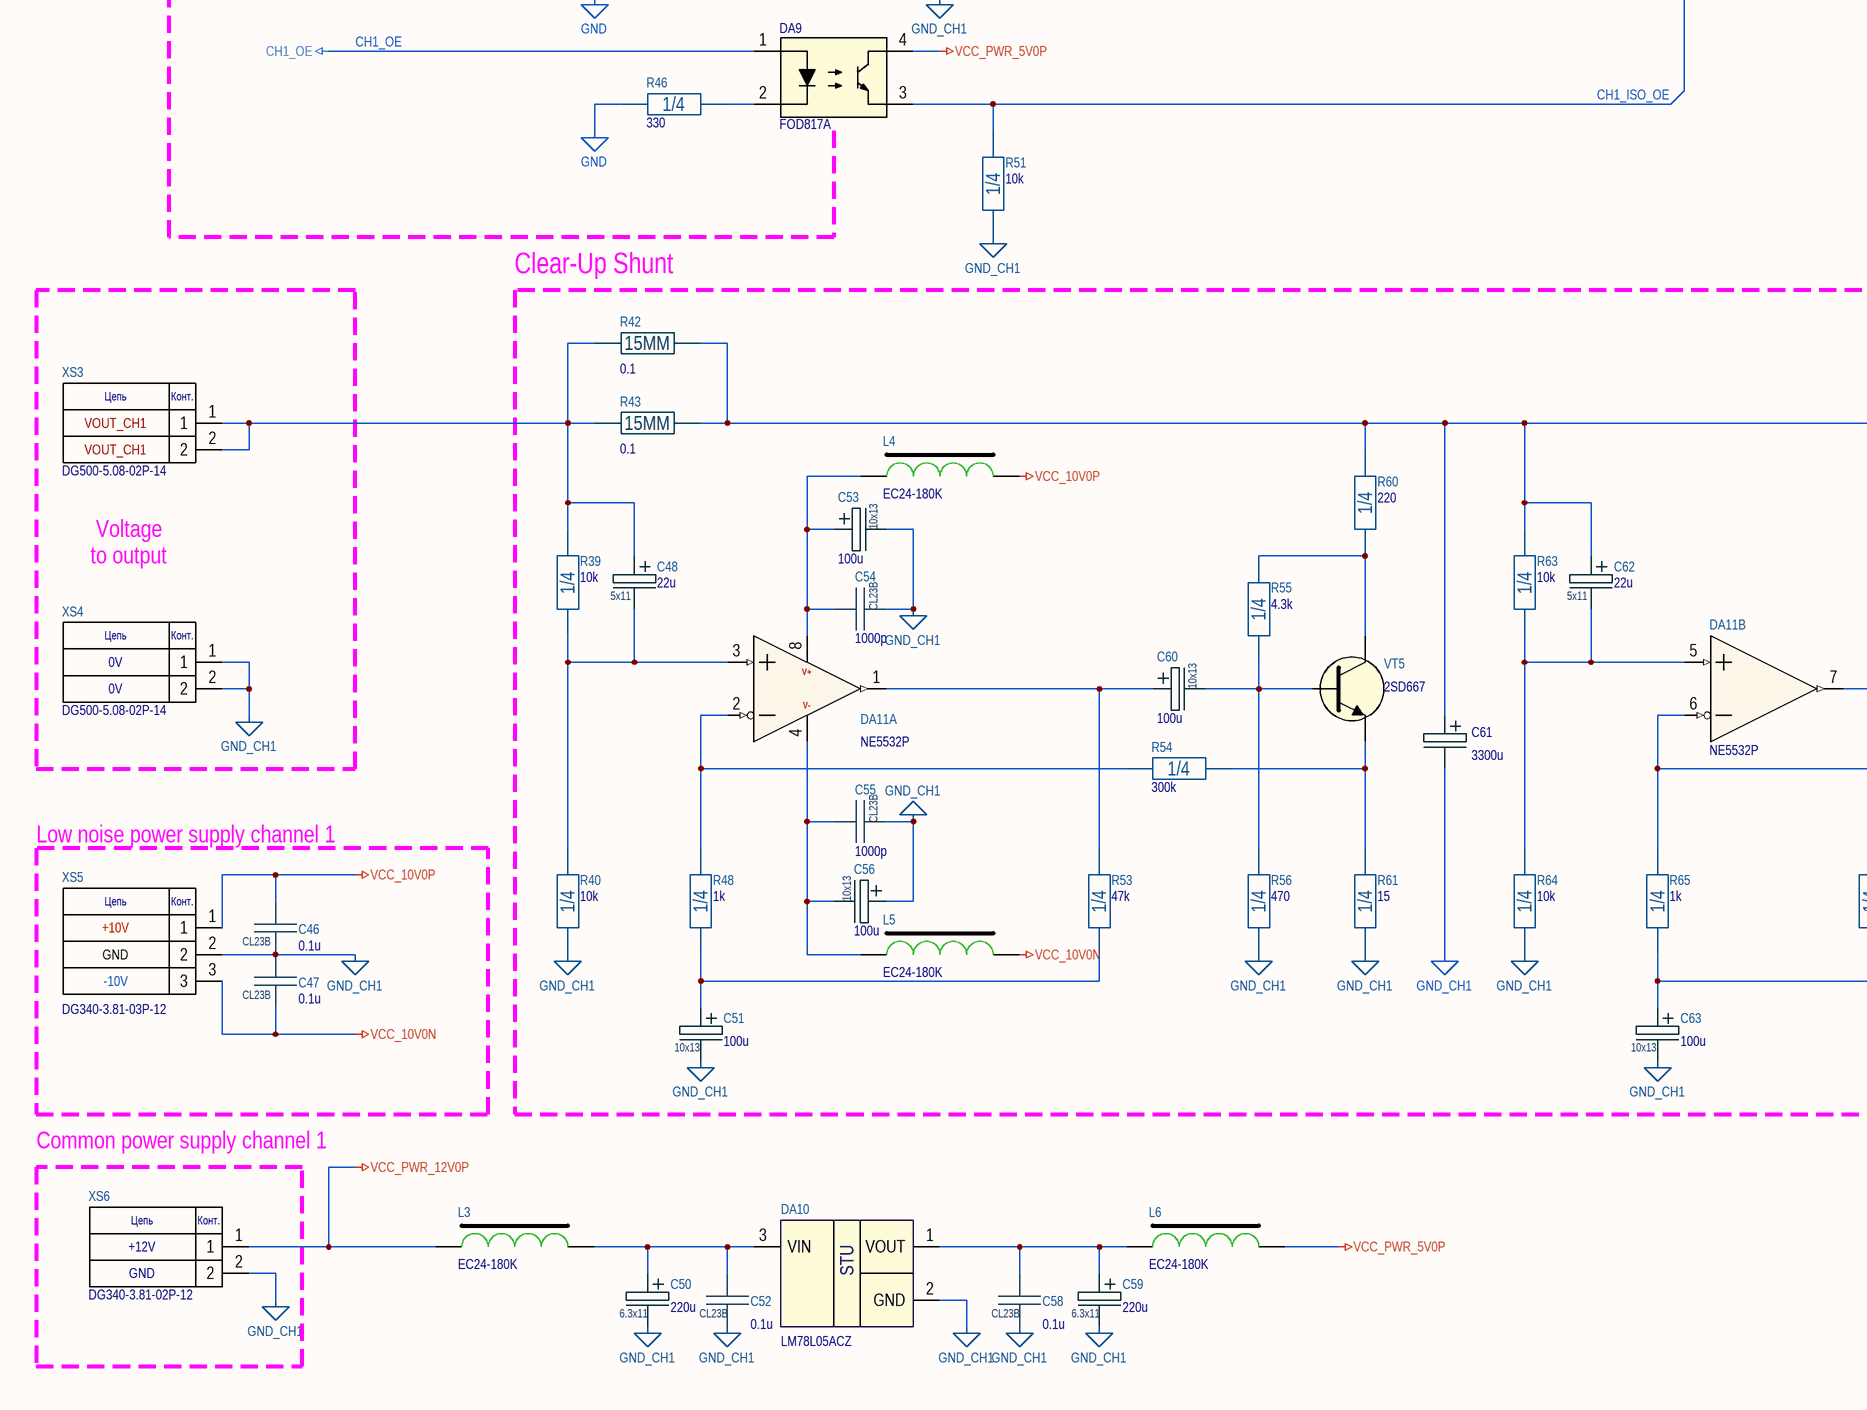
[diagram p5: p4_power_measure_ch1.SchDoc, bottom left]
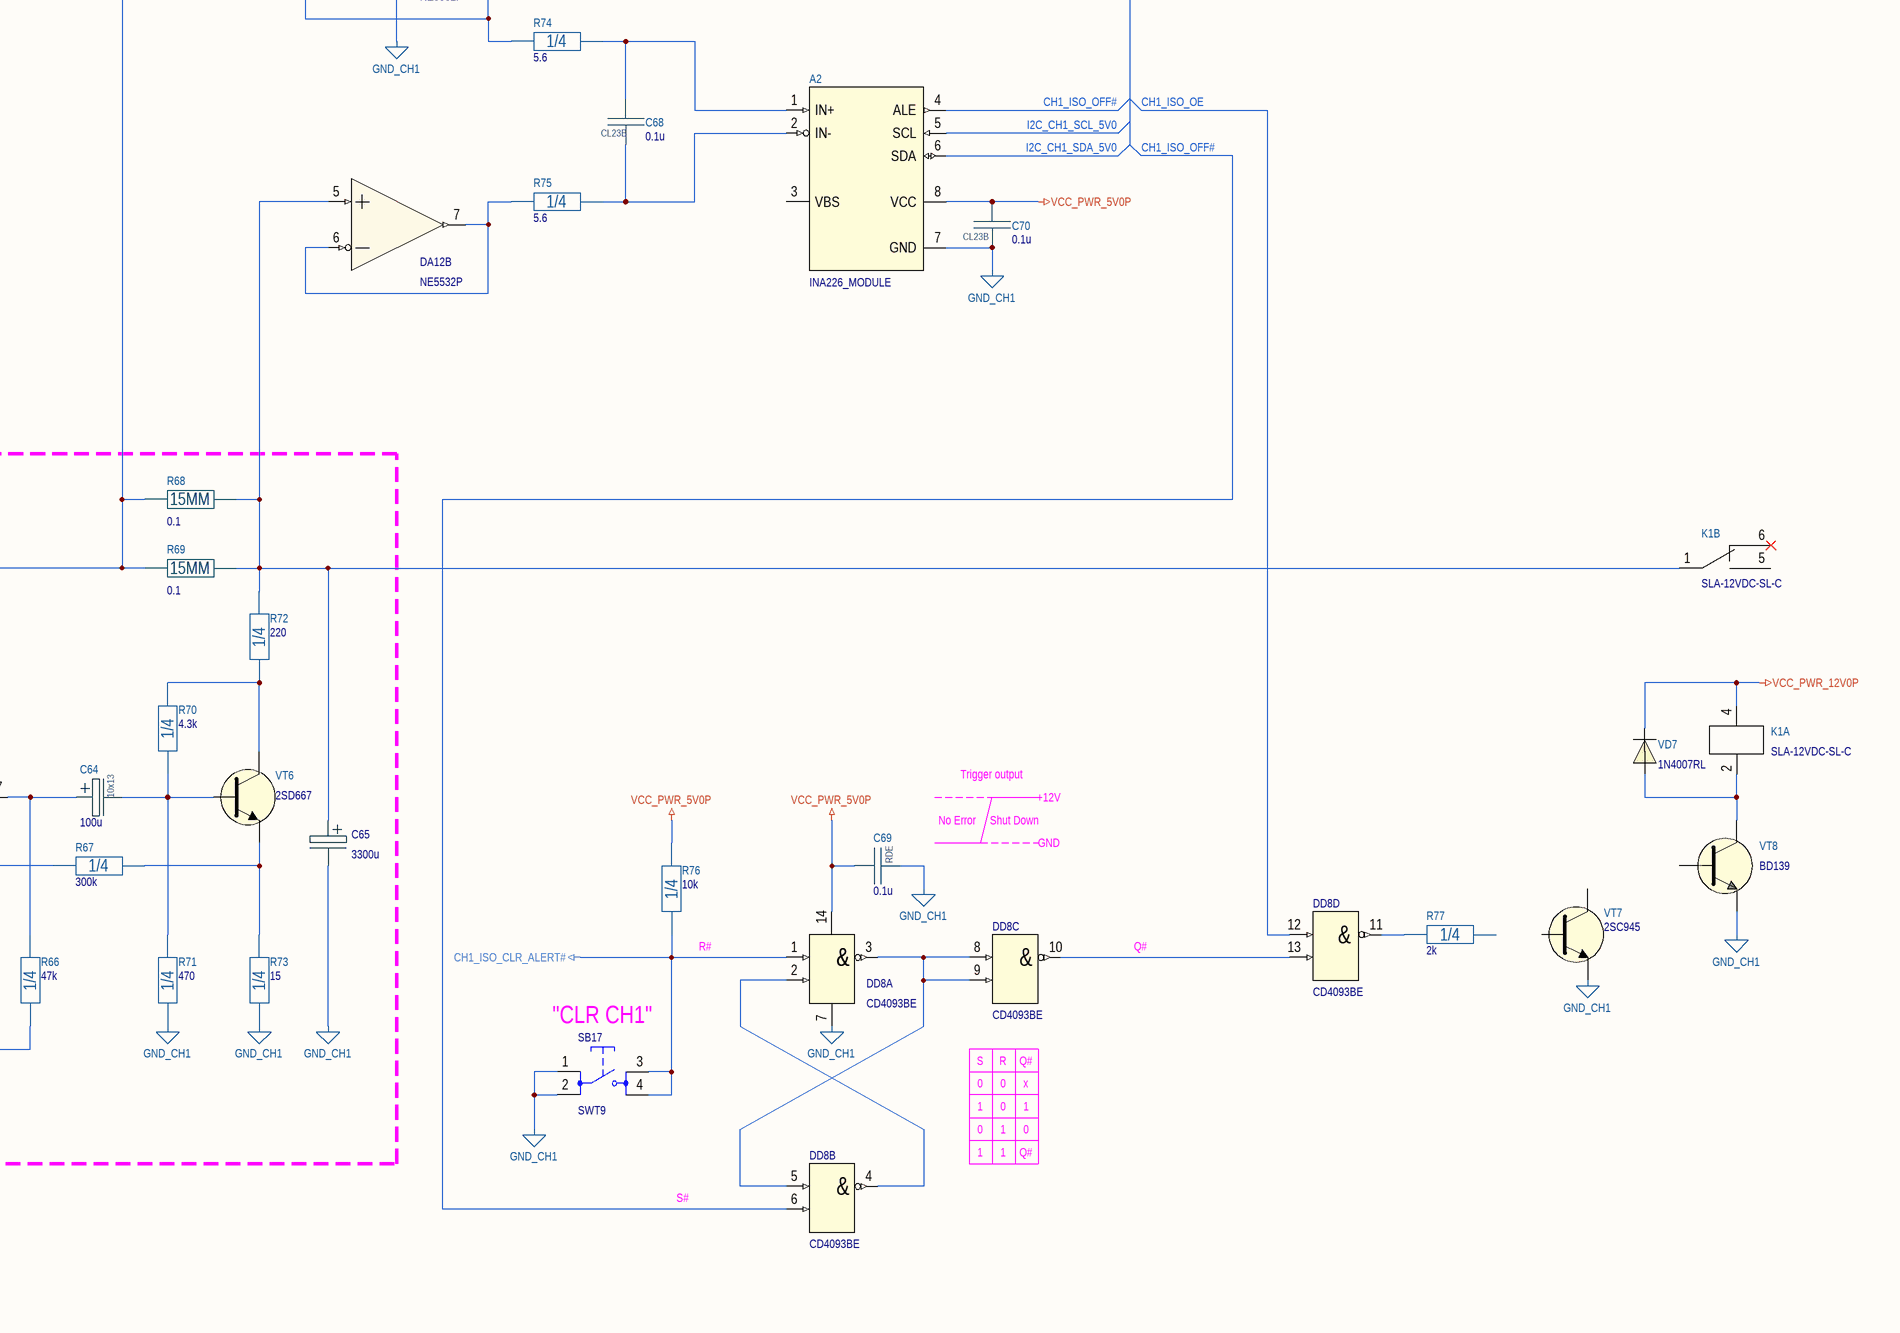
[diagram p6: p4_power_measure_ch1.SchDoc, bottom right]

### Parts
A2  INA226_MODULE  [INA226_MODULE_VERT]
C46  0.1u  [CL23B_7.2x2.5]
C47  0.1u  [CL23B_7.2x2.5]
C48  22u  Package: 5x11  [ECAP5X11X2.0_BRW]
C49  0.1u  [CL23B_7.2x2.5]
C50  220u  Package: 6.3x11  [ECAP6.3X11X2.5_BRW]
C51  100u  Package: 10x13  [ECAP10X13X5_BRW]
C52  0.1u  [CL23B_7.2x2.5]
C53  100u  Package: 10x13  [ECAP10X13X5_BRW]
C54  1000p  [CL23B_7.2x2.5]
C55  1000p  [CL23B_7.2x2.5]
C56  100u  Package: 10x13  [ECAP10X13X5_BRW]
C57  0.1u  [CL23B_7.2x2.5]
C58  0.1u  [CL23B_7.2x2.5]
C59  220u  Package: 6.3x11  [ECAP6.3X11X2.5_BRW]
C60  100u  Package: 10x13  [ECAP10X13X5_BRW]
C61  3300u  [ECAP16X36X75_BLK]
C62  22u  Package: 5x11  [ECAP5X11X2.0_BRW]
C63  100u  Package: 10x13  [ECAP10X13X5_BRW]
C64  100u  Package: 10x13  [ECAP10X13X5_BRW]
C65  3300u  [ECAP16X36X75_BLK]
C66  100u  Package: 10x13  [ECAP10X13X5_BRW]
C67  1000p  [CL23B_7.2x2.5]
C68  0.1u  [CL23B_7.2x2.5]
C69  0.1u  Package: RDE  [RDE_1P1]
C70  0.1u  [CL23B_7.2x2.5]
DA5  HCPL2630M  [DIP-8P-M01]
DA6  HCPL2630M  [DIP-8P-M01]
DA7  FOD817A  [DIP-4P]
DA8  FOD817A  [DIP-4P]
DA9  FOD817A  [DIP-4P]
DA10  LM78L05ACZ  [TO-92 (VERTICAL,LINE)]
DA11  NE5532P  [DIP-8P-M01]  (parts A,B of 2)
DA12  NE5532P  [DIP-8P-M01]  (parts A,B of 2)
DD8  CD4093BE  [DIP-14P-M02]  (parts A,B,C,D of 4)
K1  SLA-12VDC-SL-C  [RELAY_32x27.5MM]  (parts A,B of 2)
L3  EC24-180K  [EC24_GREEN]
L4  EC24-180K  [EC24_GREEN]
L5  EC24-180K  [EC24_GREEN]
L6  EC24-180K  [EC24_GREEN]
L7  EC24-180K  [EC24_GREEN]
R36  10k  Package: 1/4  [CFR-25]
R37  330  Package: 1/4  [CFR-25]
R38  10k  Package: 1/4  [CFR-25]
R39  10k  Package: 1/4  [CFR-25]
R40  10k  Package: 1/4  [CFR-25]
R41  330  Package: 1/4  [CFR-25]
R42  0.1  Package: 15MM  [CURRENT_SENSE_15x18mm]
R43  0.1  Package: 15MM  [CURRENT_SENSE_15x18mm]
R44  330  Package: 1/4  [CFR-25]
R45  330  Package: 1/4  [CFR-25]
R46  330  Package: 1/4  [CFR-25]
R47  1k  Package: 1/4  [CFR-25]
R48  1k  Package: 1/4  [CFR-25]
R49  10k  Package: 1/4  [CFR-25]
R50  10k  Package: 1/4  [CFR-25]
R51  10k  Package: 1/4  [CFR-25]
R52  330  Package: 1/4  [CFR-25]
R53  47k  Package: 1/4  [CFR-25]
R54  300k  Package: 1/4  [CFR-25]
R55  4.3k  Package: 1/4  [CFR-25]
R56  470  Package: 1/4  [CFR-25]
R57  10k  Package: 1/4  [CFR-25]
R58  330  Package: 1/4  [CFR-25]
R59  330  Package: 1/4  [CFR-25]
R60  220  Package: 1/4  [CFR-25]
R61  15  Package: 1/4  [CFR-25]
R62  330  Package: 1/4  [CFR-25]
R63  10k  Package: 1/4  [CFR-25]
R64  10k  Package: 1/4  [CFR-25]
R65  1k  Package: 1/4  [CFR-25]
R66  47k  Package: 1/4  [CFR-25]
R67  300k  Package: 1/4  [CFR-25]
R68  0.1  Package: 15MM  [CURRENT_SENSE_15x18mm]
R69  0.1  Package: 15MM  [CURRENT_SENSE_15x18mm]
R70  4.3k  Package: 1/4  [CFR-25]
R71  470  Package: 1/4  [CFR-25]
R72  220  Package: 1/4  [CFR-25]
R73  15  Package: 1/4  [CFR-25]
R74  5.6  Package: 1/4  [CFR-25(VERTICAL)]
R75  5.6  Package: 1/4  [CFR-25(VERTICAL)]
R76  10k  Package: 1/4  [CFR-25]
R77  2k  Package: 1/4  [CFR-25]
SB17  SWT9  [SWT9]
VD5  BAT42  [DO-35 GLASS BLUE]
VD6  BAT42  [DO-35 GLASS BLUE]
VD7  1N4007RL  [DO-41]
VT1  2SA733  [TO-92 (VERTICAL,LINE)]
VT2  2SA733  [TO-92 (VERTICAL,LINE)]
VT3  2SA733  [TO-92 (VERTICAL,LINE)]
VT4  2SA733  [TO-92 (VERTICAL,LINE)]
VT5  2SD667  [TO-92L (VERTICAL,LINE)]
VT6  2SD667  [TO-92L (VERTICAL,LINE)]
VT7  2SC945  [TO-92 (VERTICAL,LINE)]
VT8  BD139  [TO-126 (VERTICAL)]
XS3  DG500-5.08-02P-14  [DG500-5.08-02P]
XS4  DG500-5.08-02P-14  [DG500-5.08-02P]
XS5  DG340-3.81-03P-12  [DG340-3.81-03P]
XS6  DG340-3.81-02P-12  [DG340-3.81-02P]

### Blocks framed on the sheet
Low noise power supply channel 1: C46 C47 XS5

### Nets
CH1_CLR_ALERT#: DA7.1(ANODE) DA9.1(ANODE)  [also labelled CH1_OE]
CH1_ISO_CLR_ALERT#: DA7.4(COLLECTOR) DD8.1(A0) R49.1 R76.1 SB17.3 SB17.4
CH1_OFF#: DA8.1(ANODE)
GND: C49.1 DA5.5(GND) R41.1 R44.1 R45.1 R46.1 VT1.2(C)
GND_CH1: A2.7(GND) C46.2 C47.1 C50.2 C51.2 C52.2 C53.2 C54.2 C55.2 C56.1 C57.1 C58.2 C59.2 C61.2 C63.2 C65.2 C66.2 C67.2 C69.2 C70.2 DA6.5(GND) DA7.3(EMITTER) DA8.3(EMITTER) DA10.2(GND) DA12.4(GND) DD8.7(GND) R40.1 R51.1 R52.2 R56.1 R61.1 R64.1 R71.1 R73.1 SB17.1 SB17.2 VT4.2(C) VT7.3(E) VT8.3(E) XS4.1 XS4.2 XS5.2 XS6.2
I2C_CH1_ALERT: DA5.7(V01) R47.2
I2C_CH1_SCL: R38.1 VT2.1(B)
I2C_CH1_SDA: R36.1 VD5.2(ANODE) VT1.1(B)
VCC_3V3P: C49.2 DA5.8(VCC) R36.2 R37.1 R38.2 R47.1 VT2.3(E)
VCC_10V0N: C47.2 L5.2 XS5.3
VCC_10V0P: C46.1 L4.2 L7.2 XS5.1
VCC_PWR_5V0P: A2.8(VCC) C57.2 C69.1 C70.1 DA6.8(VCC) DA9.4(COLLECTOR) DD8.14(VCC) L6.2 R49.2 R50.2 R57.2 R58.1 R59.1 R62.1 R76.2 VT3.3(E)
VCC_PWR_12V0P: K1.4 L3.1 VD7.1(C) XS6.1
CH1_ISO_OE: DA9.3(EMITTER) DD8.12(A3) R51.2
CH1_ISO_OFF#: A2.4(ALE) DA8.4(COLLECTOR) DD8.6(B1) R50.1 R57.1 VT3.1(B)
I2C_CH1_SCL_5V0: A2.5(SCL) DA6.6(V02) R62.2
I2C_CH1_SDA_5V0: A2.6(SDA) R59.2 VD6.2(ANODE) VT4.1(B)
NetA2_1: A2.1(IN+) C68.2 R74.2
NetA2_2: A2.2(IN-) C68.1 R75.2
NetC48_1: C48.1 R39.2 R42.1 R43.1 XS3.1 XS3.2
NetC48_2: C48.2 DA11.3(1IN+) R39.1 R40.2
NetC50_1: C50.1 C52.1 DA10.3(VIN) L3.2
NetC51_1: C51.1 R48.1 R53.1
NetC53_1: C53.1 C54.1 DA11.8(VCC) L4.1
NetC55_1: C55.1 C56.2 DA11.4(GND) L5.1
NetC58_1: C58.1 C59.1 DA10.1(VOUT) L6.1
NetC60_1: C60.1 DA11.1(1OUT) R53.2
NetC60_2: C60.2 R55.1 R56.2 VT5.3(B)
NetC61_1: C61.1 C62.1 DA12.3(1IN+) R42.2 R43.2 R60.2 R63.2 R68.1 R69.1
NetC62_2: C62.2 DA11.5(2IN+) R63.1 R64.2
NetC63_1: C63.1 R65.1 R66.1
NetC64_1: C64.1 DA11.7(2OUT) R66.2
NetC64_2: C64.2 R70.1 R71.2 VT6.3(B)
NetC65_1: C65.1 DA12.5(2IN+) K1.1 R68.2 R69.2 R72.2
NetC66_1: C66.1 C67.1 DA12.8(VCC) L7.1
NetDA5_1: DA5.1(ANODE1) VT3.2(C)
NetDA5_2: DA5.2(CATHODE1) R52.1
NetDA5_3: DA5.3(CATHODE2) VT4.3(E)
NetDA5_4: DA5.4(ANODE2) DA6.7(V01) R58.2 VD6.1(CATHODE)
NetDA5_6: DA5.6(V02) DA6.1(ANODE1) R37.2 VD5.1(CATHODE)
NetDA6_2: DA6.2(CATHODE1) VT1.3(E)
NetDA6_3: DA6.3(CATHODE2) R41.2
NetDA6_4: DA6.4(ANODE2) VT2.2(C)
NetDA7_2: DA7.2(CATHODE) R44.2
NetDA8_2: DA8.2(CATHODE) R45.2
NetDA9_2: DA9.2(CATHODE) R46.2
NetDA11_2: DA11.2(1IN-) R48.2 R54.2
NetDA11_6: DA11.6(2IN-) R65.2 R67.2
NetDA12_1: DA12.1(1OUT) DA12.2(1IN-) R74.1
NetDA12_6: DA12.6(2IN-) DA12.7(2OUT) R75.1
NetDD8_2: DD8.2(B0) DD8.4(Y1)
NetDD8_3: DD8.3(Y0) DD8.5(A1) DD8.8(A2) DD8.9(B2)
NetDD8_10: DD8.10(Y2) DD8.13(B3)
NetDD8_11: DD8.11(Y3) R77.1
NetK1_2: K1.2 VD7.2(A) VT8.2(C)
NetR54_1: R54.1 R61.2 VT5.1(E)
NetR55_2: R55.2 R60.1 VT5.2(C)
NetR67_1: R67.1 R73.2 VT6.1(E)
NetR70_2: R70.2 R72.1 VT6.2(C)

Not connected (* = marked no-connect by the designer): A2 3(VBS); K1 5 6*; R77 2; VT7 1(B) 2(C); VT8 1(B)

### Notes on the sheet
- to Raspberry Pi Pico
- Clear-Up Shunt
- (near XS3) VOUT_CH1
- Voltage
- to output
- 0V
- No Error
- Trigger output
- Shut Down
- +12V
- GND
- (near R76) R#
- Q#
- +10V
- -10V
- (near SB17) "CLR CH1"
- S
- 0
- 1
- R
- x
- Common power supply channel 1
- S#
- Title
- Size:
- Date:
- File:
- A1
- Number:
- Time:
- Revision:
- Sheet
- of
- (in symbol CD4093BE, part A) &
- (in symbol CD4093BE, part B) &
- (in symbol CD4093BE, part C) &
- (in symbol CD4093BE, part D) &
- (in symbol DG340-3.81-02P-12) Цепь; Конт.
- (in symbol DG340-3.81-03P-12) Цепь; Конт.
- (in symbol DG500-5.08-02P-14) Цепь; Конт.
- (in symbol LM78L05ACZ) STU
- (in symbol NE5532P, part A) V+; V-

### Library data of the parts
A2 = INA226_MODULE: 20x20mm module with INA226; Part Number: INA226_MODULE
C46 C47 C49 C52 C54 C55 C57 C58 C67 C68 C70 = CL23B: as C2 on sheet p1_control_block; Dielectric: Polyester; Part Number: *; Manufacturer: *; Package: CL23B
  C46 C47 C49 C52 C57 C58 C68 C70: Value: 0.1u; Value on schem: 0.1u
  C54 C55 C67: Value: 1000p; Value on schem: 1000p
C48 C62 = C_ECAP: Aluminium capacitor; Part Number: UVR1J220MDD; Manufacturer: Nichicon; Tolerance: ± 20 %; Voltage: 63V; Value: 22u; Value on schem: 22u
C50 C59 = C_ECAP: as C12 on sheet p2_eth_rs232; Value: 220u; Value on schem: 220u
C51 C53 C56 C60 C63 C64 C66 = C_ECAP: Aluminium capacitor; Manufacturer: Nichicon; Tolerance: ± 20 %; Voltage: 63V; Value: 100u; Value on schem: 100u
C61 C65 = C_ECAP: Aluminium capacitor; Part Number: RD1H338M1635MPA; Manufacturer: Samwha; Tolerance: ± 20 %; Voltage: 50V; Value: 3300u; Value on schem: 3300u; Package: 16x36
C69 = RDE_CAP: as C34 on sheet p3_keypad_encoder_led; Value: 0.1u; Value on schem: 0.1u
DA5 DA6 = HCPL2630M: as DA2 on sheet p2_eth_rs232; Package: DIP-8; Part Number: HCPL2630M
DA7-DA9 = FOD817A: 5kV Phototransistor Optocoupler; Manufacturer: ON Semiconductor; Package: DIP-4; Part Number: FOD817A
DA10 = LM78L05ACZ: as DA4 on sheet p2_eth_rs232; Part Number: LM78L05ACZ; Package: TO-92
DA11 DA12 = NE5532P: DUAL LOW-NOISE OPERATIONAL AMPLIFIERS; Manufacturer: Texas Instruments; Part Number: NE5532P; Package: DIP-8
DD8 = CD4093BE: Quad 2-Input NAND Gate Schmitt Triggers; Manufacturer: Texas Instruments; Part Number: CD4093BE; Package: DIP-14
K1 = SLA-12VDC-SL-C: Subminature high power relay 4P 30A; Manufacturer: Songle Relay; Coil Power Dissipation: 0.9W; Coil Current: 12V@75mA; Coil Resistance: 160 Ohm; Package: 32mm x27.5mm; Part Number: SLA-12VDC-SL-C
L3-L7 = EC24: as L1 on sheet p2_eth_rs232; Part Number: EC24-180K; Package: EC24
R36 R38-R40 R49-R51 R57 R63 R64 R76 = CF25: as R3 on sheet p1_control_block; Value: 10k; Value on schem: 10k
R37 R41 R44-R46 R52 R58 R59 R62 = CF25: Resistor 1/4W; Part Number: MFR-25FTF52-330R; Manufacturer: Yageo; Tolerance: ± 1 %; Voltage: 250V; Temperature Coefficient: ±100 ppm/°C; Value: 330; Value on schem: 330
R42 R43 R68 R69 = SHUNT_15MM: Constantan shunt resistor, pitch = 15mm; Tolerance: ±  %; Temperature Coefficient: ±*/°C; Value: 0.1; Value on schem: 0.1; Part Number: *; Manufacturer: *; Voltage: *
R47 R48 R65 = CF25: as R5 on sheet p2_eth_rs232; Value: 1k; Value on schem: 1k
R53 R66 = CF25: Resistor 1/4W; Part Number: MFR-25FTF52-47K; Manufacturer: Yageo; Tolerance: ± 1 %; Voltage: 250V; Temperature Coefficient: ±100 ppm/°C; Value: 47k; Value on schem: 47k
R54 R67 = CF25: Resistor 1/4W; Part Number: MFR-25FTF52-300K; Manufacturer: Yageo; Tolerance: ± 1 %; Voltage: 250V; Temperature Coefficient: ±100 ppm/°C; Value: 300k; Value on schem: 300k
R55 R70 = CF25: Resistor 1/4W; Part Number: MFR-25FTF52-4K3; Manufacturer: Yageo; Tolerance: ± 1 %; Voltage: 250V; Temperature Coefficient: ±100 ppm/°C; Value: 4.3k; Value on schem: 4.3k
R56 R71 = CF25: as R15 on sheet p3_keypad_encoder_led; Value: 470; Value on schem: 470
R60 R72 = CF25: Resistor 1/4W; Part Number: MFR-25FTF52-220R; Manufacturer: Yageo; Tolerance: ± 1 %; Voltage: 250V; Temperature Coefficient: ±100 ppm/°C; Value: 220; Value on schem: 220
R61 R73 = CF25: Resistor 1/4W; Part Number: MFR-25FTF52-15R; Manufacturer: Yageo; Tolerance: ± 1 %; Voltage: 250V; Temperature Coefficient: ±100 ppm/°C; Value: 15; Value on schem: 15
R74 R75 = CF25: Resistor 1/4W; Part Number: MFR-25FTF52-5R6; Manufacturer: Yageo; Tolerance: ± 1 %; Voltage: 250V; Temperature Coefficient: ±100 ppm/°C; Value: 5.6; Value on schem: 5.6
R77 = CF25: Resistor 1/4W; Part Number: MFR-25FTF52-2K; Manufacturer: Yageo; Tolerance: ± 1 %; Voltage: 250V; Temperature Coefficient: ±100 ppm/°C; Value: 2k; Value on schem: 2k
SB17 = SWT9: Tact Button (with tact cap SWT9S); Part Number: SWT9
VD5 VD6 = BAT42: Small signal schottky diode 30V @ 200mA; Manufacturer: STMicroelectronics; Package: DO-35; Part Number: BAT42
VD7 = 1N4007RL: 1A 1000V Standard Recovery Rectifiers Diode; Manufacturer: ON Semiconductor; Part Number: 1N4007RL; Package: DO-41
VT1-VT4 = 2SA733: General Purpose p-n-p Transistors; Manufacturer: NEC; Package: TO-92; Part Number: 2SA733
VT5 VT6 = 2SD667: General Purpose n-p-n Transistors 120V, 1A; Manufacturer: Secos; Package: TO-92L; Part Number: 2SD667
VT7 = 2SC945: General Purpose n-p-n Transistors; Manufacturer: NEC; Package: TO-92; Part Number: 2SC945
VT8 = BD139: General Purpose n-p-n Transistors; Manufacturer: STMicroelectronics; Package: TO-126; Part Number: BD139
XS3 XS4 = DG500-5.08-02P-14: 2-way screw terminal, pitch 200mils (5.08mm); Manufacturer: DEGSON; Part Number: DG500-5.08-02P-14
XS5 = DG340-3.81-03P-12: 3-way screw terminal, pitch 150mils (3.81mm); Manufacturer: DEGSON; Part Number: DG340-3.81-03P-12
XS6 = DG340-3.81-02P-12: as XS1 on sheet p1_control_block; Part Number: DG340-3.81-02P-12

## Nets that join several sheets
CH1_CLR_ALERT#: p1_control_block (XP1.6), p4_power_measure_ch1 (DA7.1 DA9.1)
GND: p1_control_block (28 pins), p2_eth_rs232 (26 pins), p3_keypad_encoder_led (38 pins), p4_power_measure_ch1 (7 pins)
PERIPH_INT#: p1_control_block (A1.19), p3_keypad_encoder_led (DD5.13 DD6.13 DD?.13)
PERIPH_SCL: p1_control_block (A1.25 DD2.6), p3_keypad_encoder_led (DD5.15 DD6.15 DD?.15)
PERIPH_SDA: p1_control_block (A1.24 DD2.5), p3_keypad_encoder_led (DD5.14 DD6.14 DD?.14)
VCC_3V3P: p1_control_block (14 pins), p2_eth_rs232 (10 pins), p3_keypad_encoder_led (25 pins), p4_power_measure_ch1 (7 pins)
VCC_SOURCE_7V0P: p1_control_block (XS1.1), p2_eth_rs232 (L1.1)